# EAGLE board microEEG321w (EAGLE 6.5.0), part 1 of 3
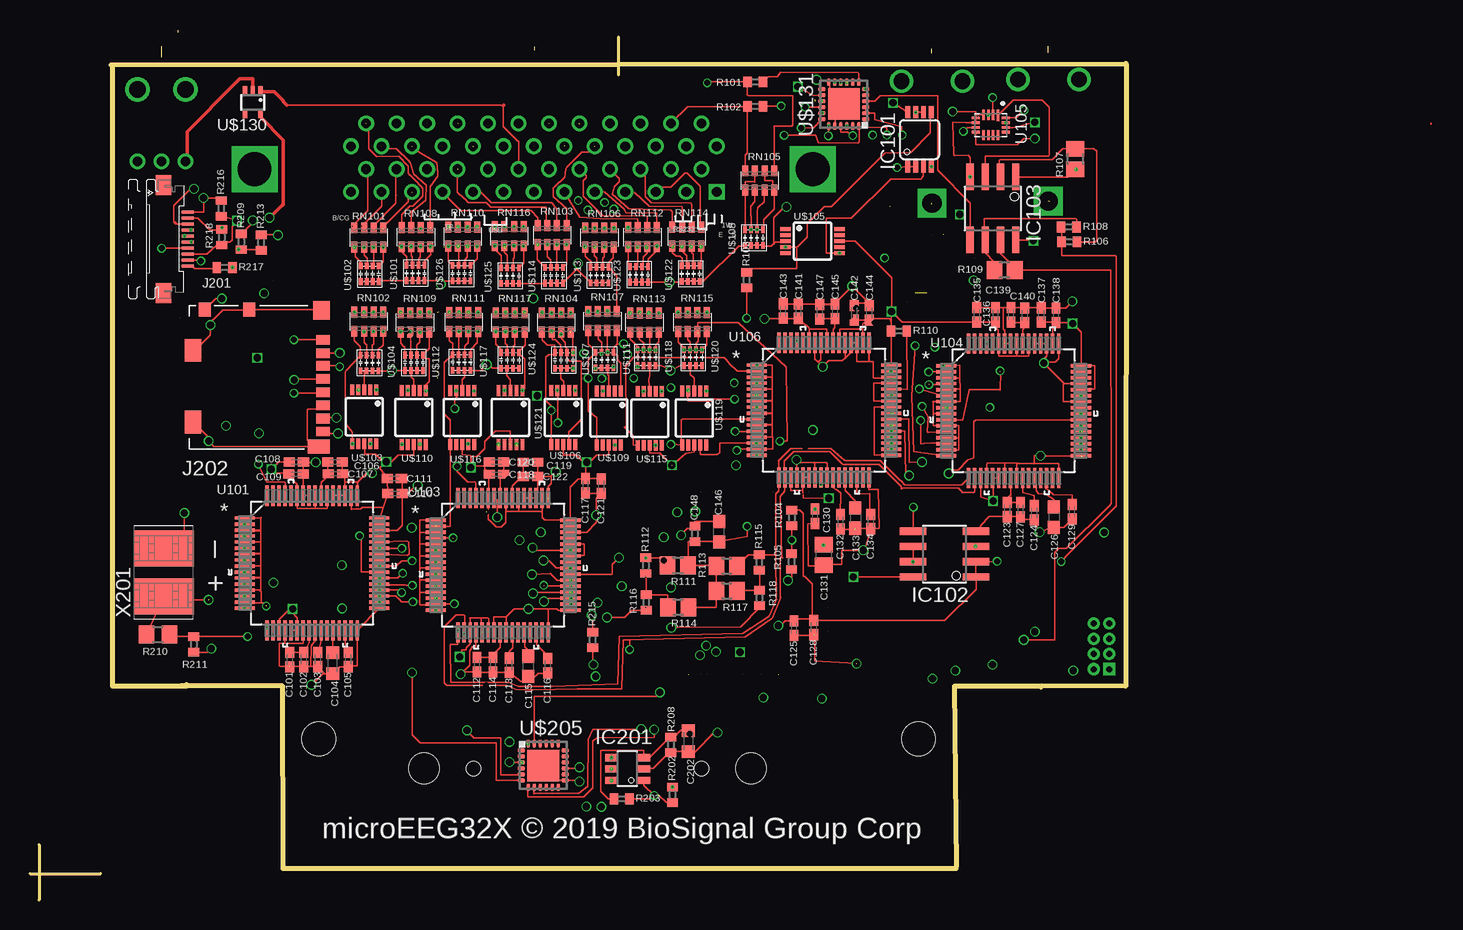
[diagram p7: board, top side]
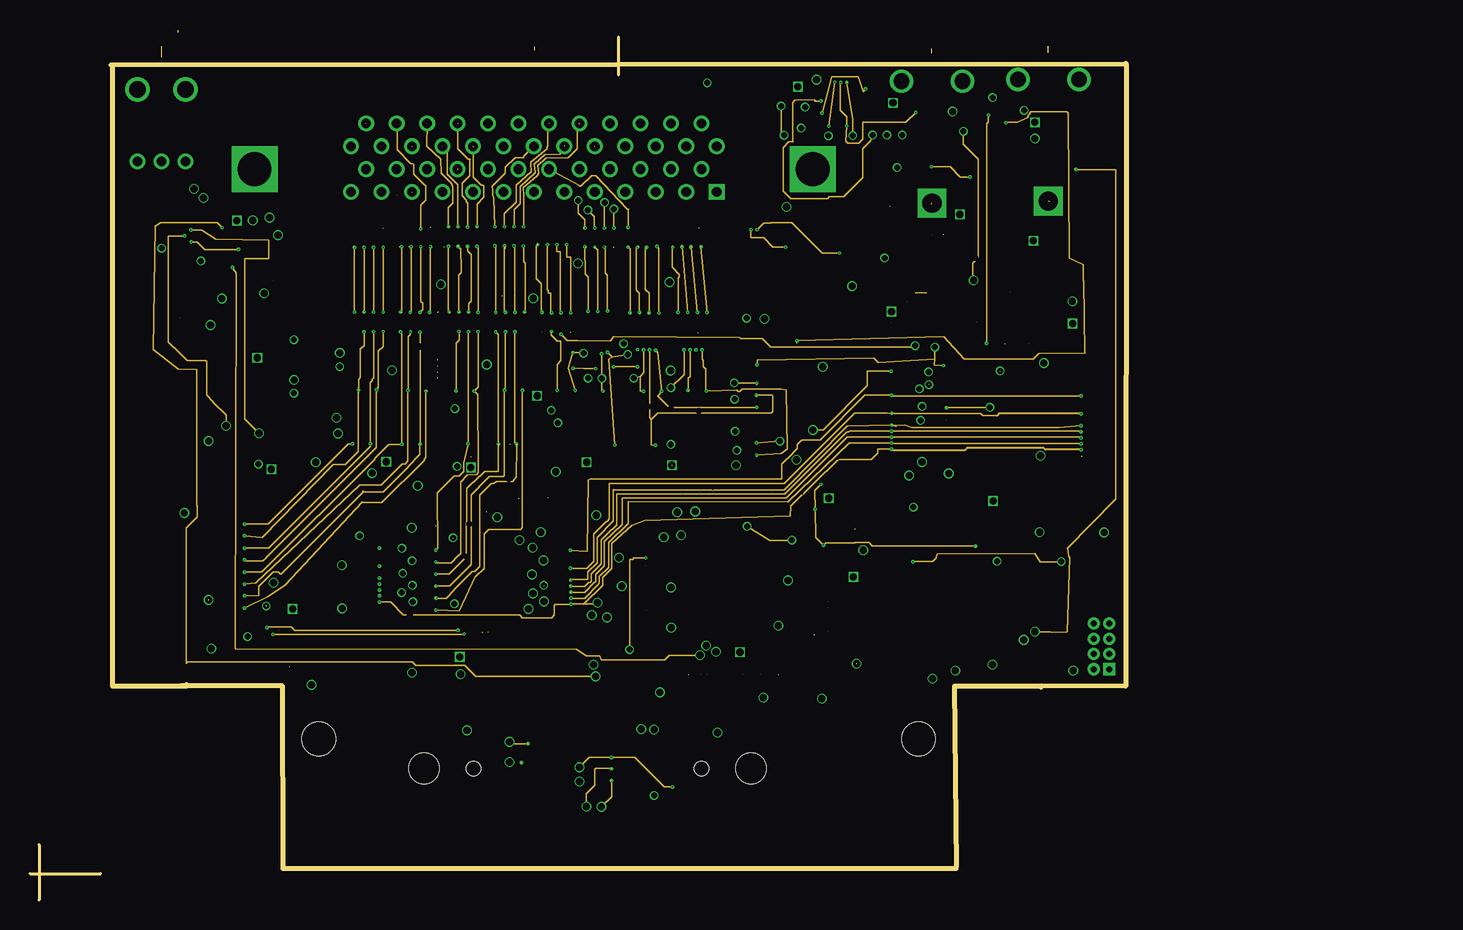
[diagram p8: board, inner layer Route2]
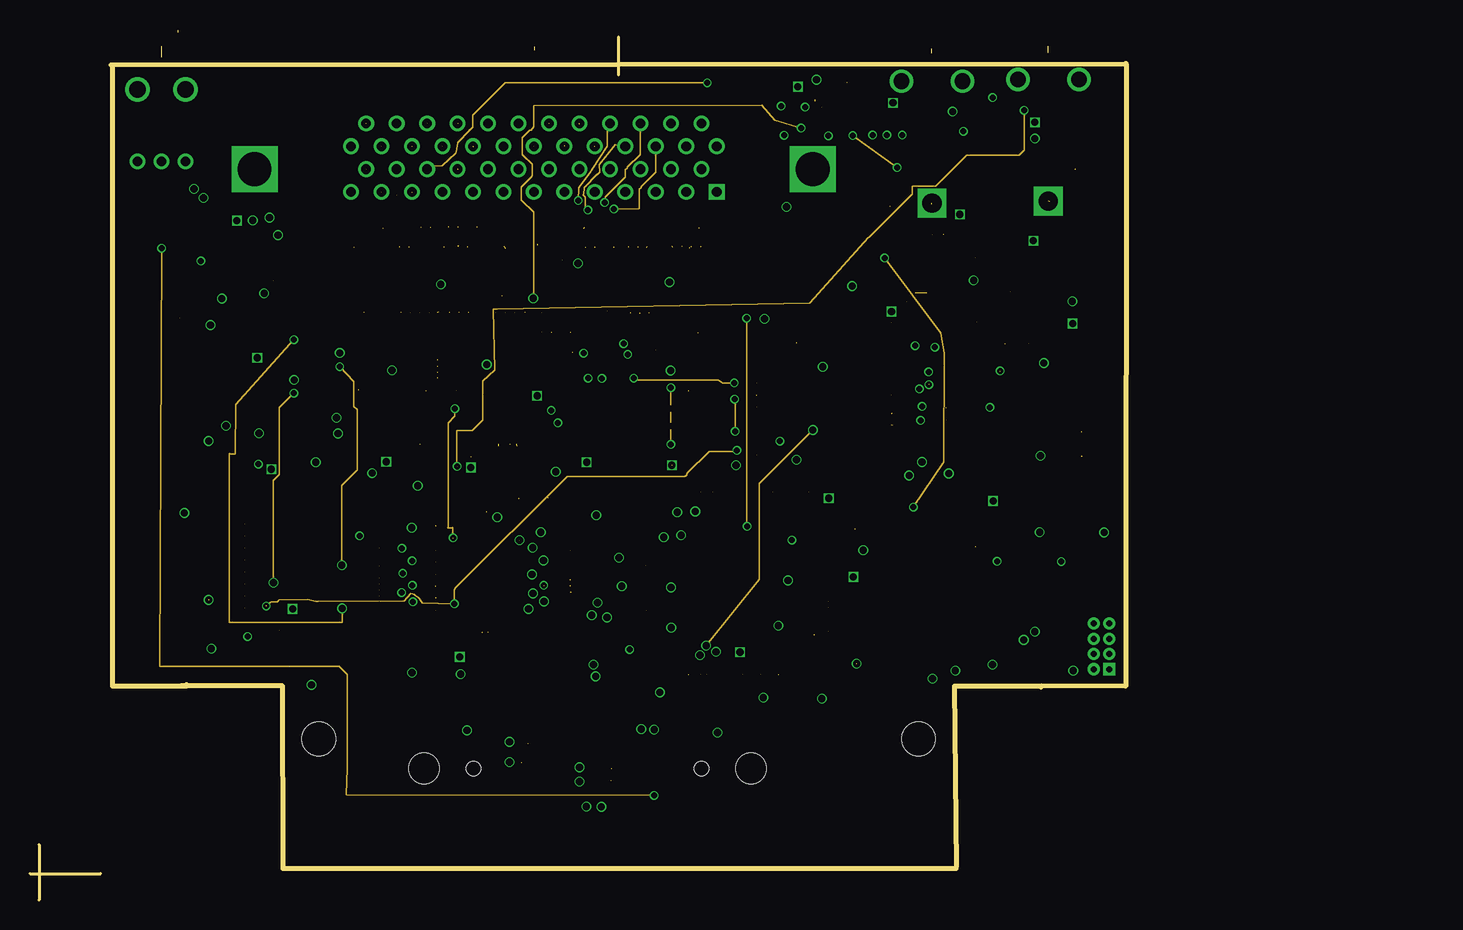
[diagram p9: board, inner layer Route3]
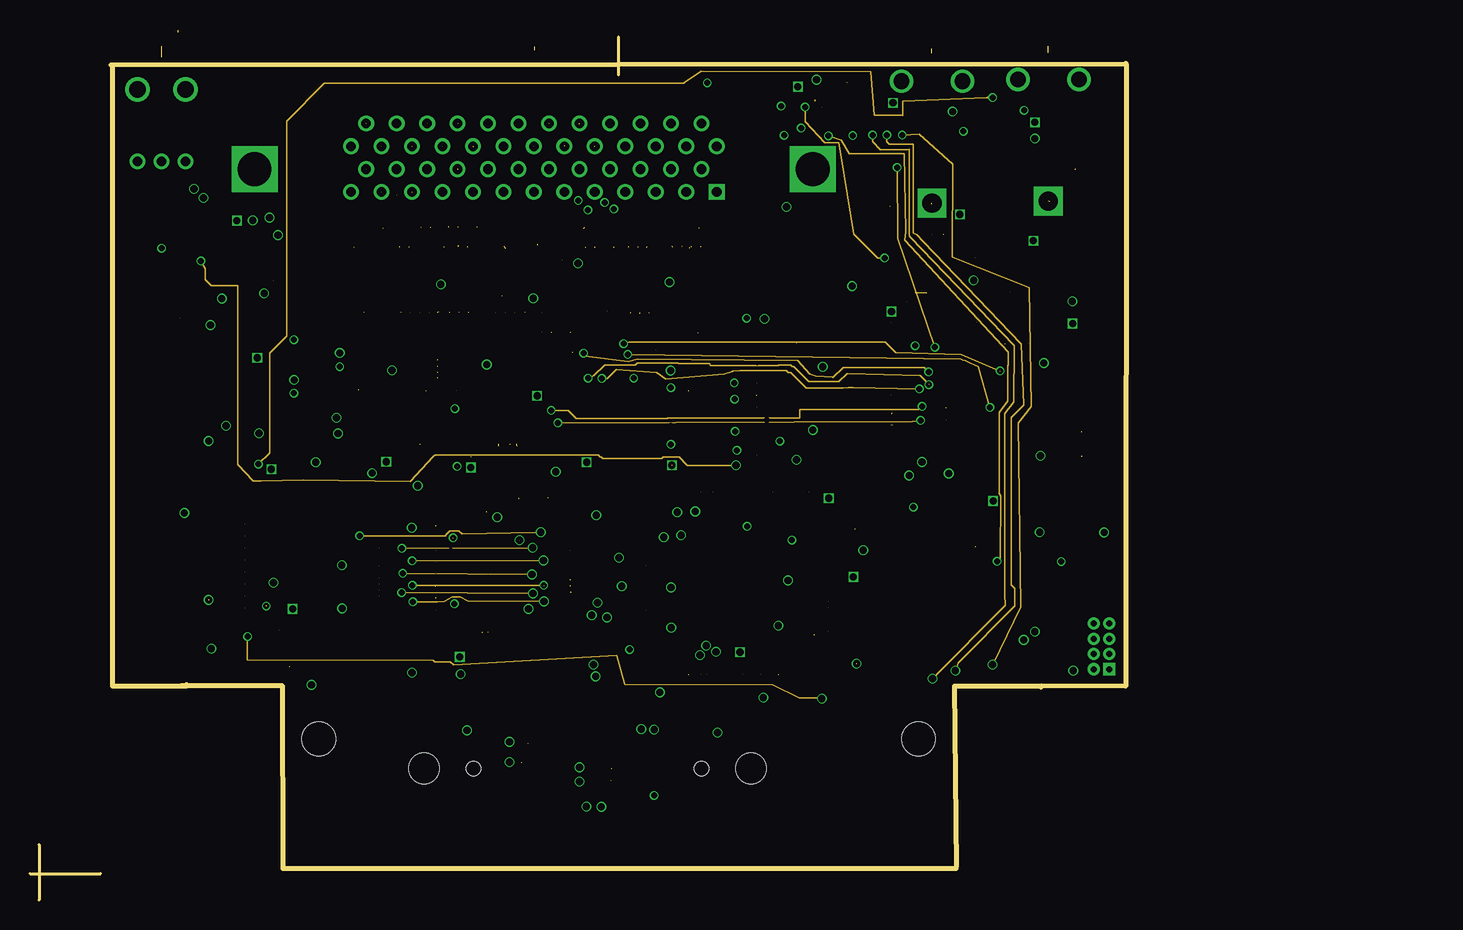
[diagram p10: board, inner layer Route4]
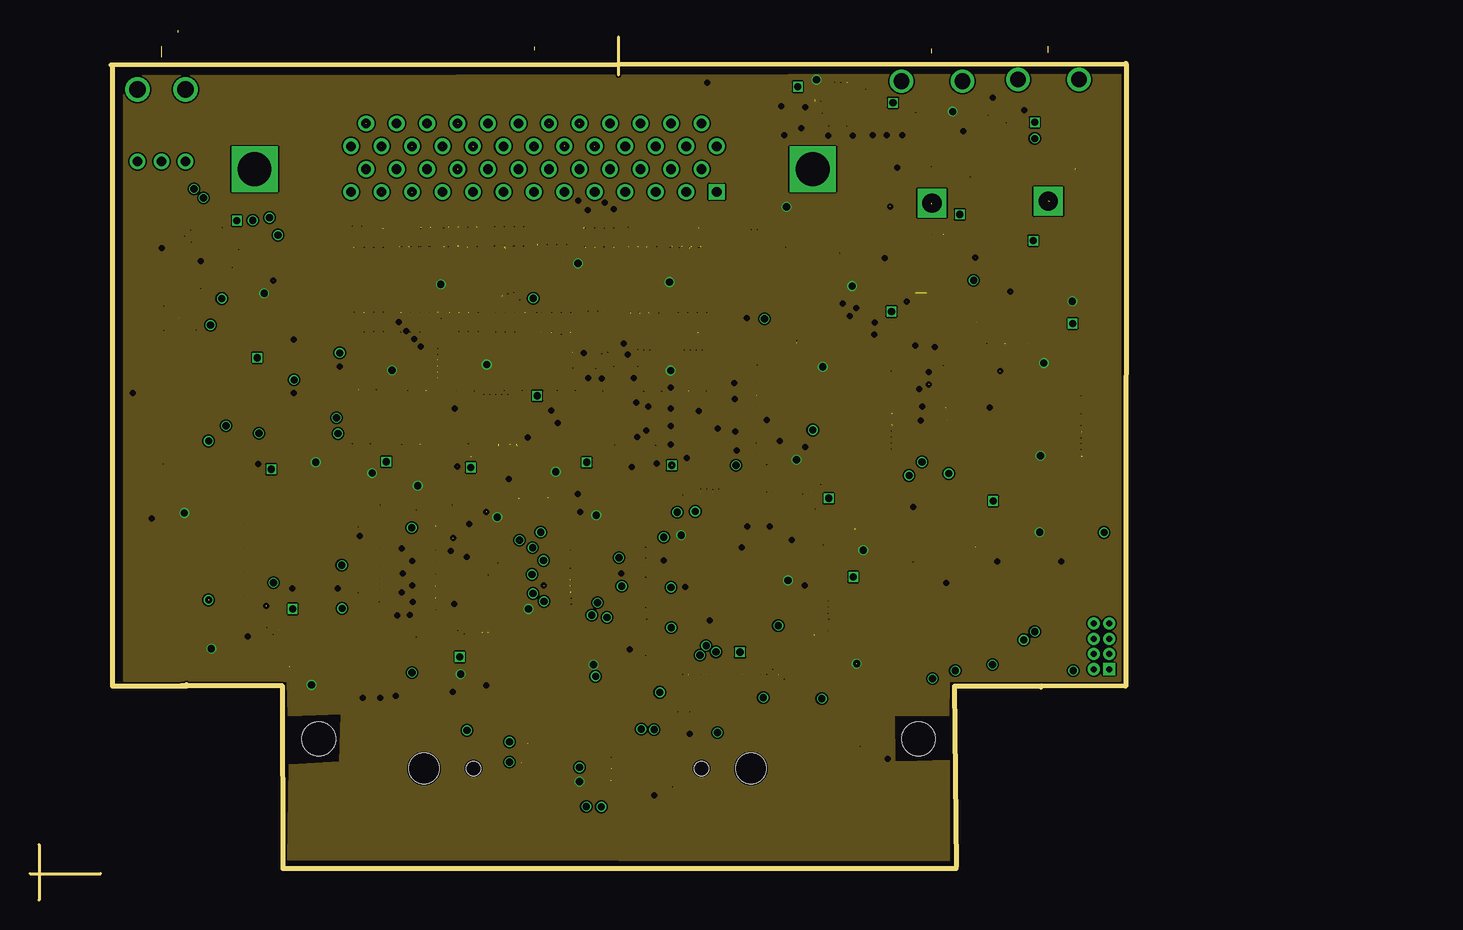
[diagram p11: board, inner layer Route5]
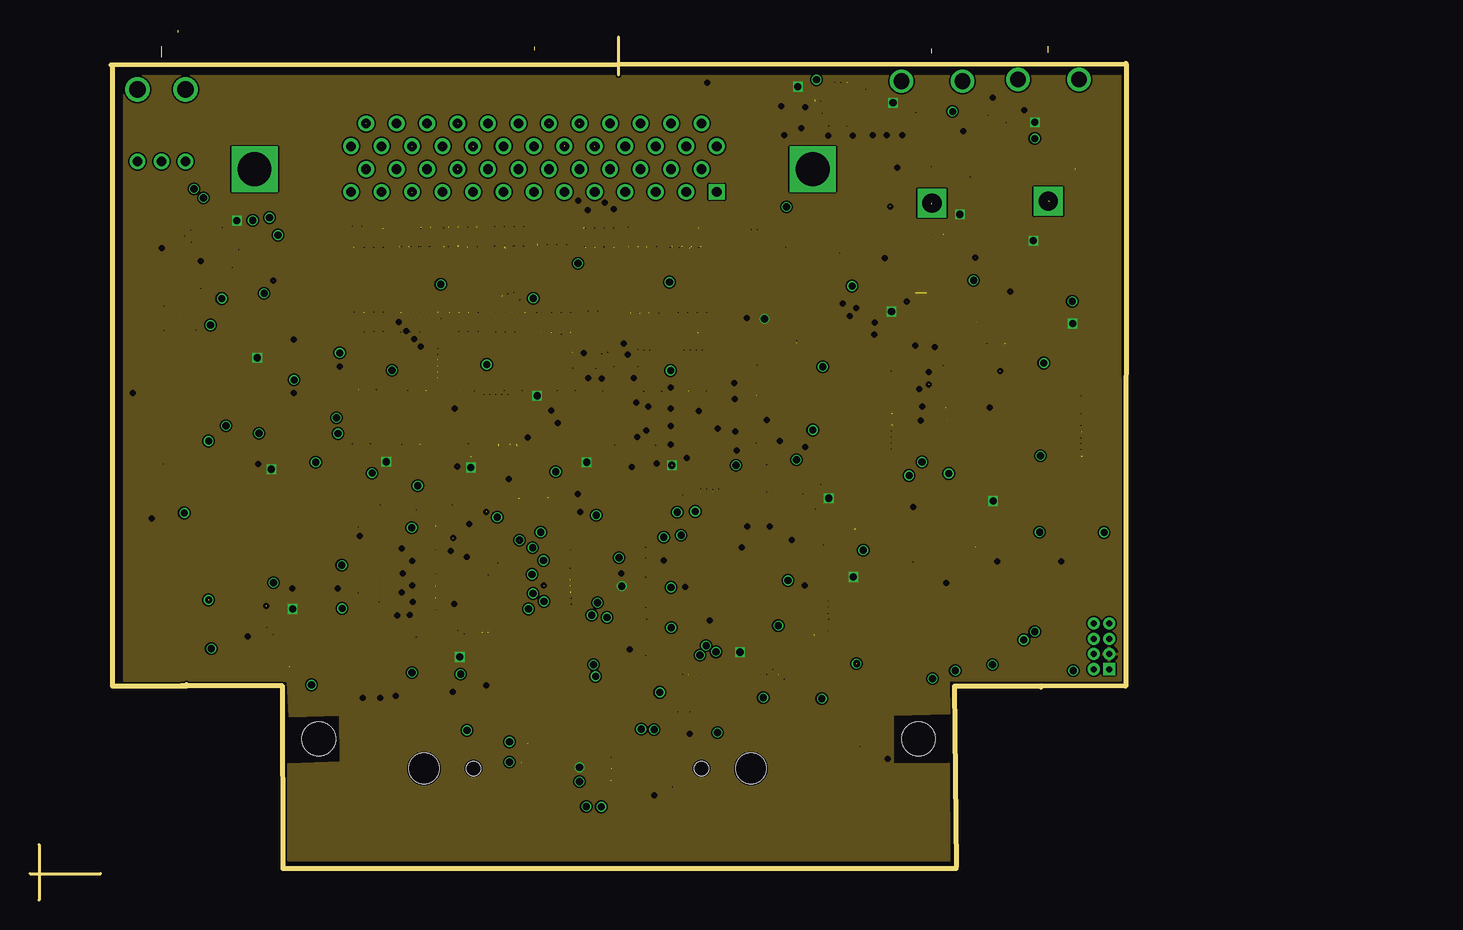
[diagram p12: board, inner layer Route12]
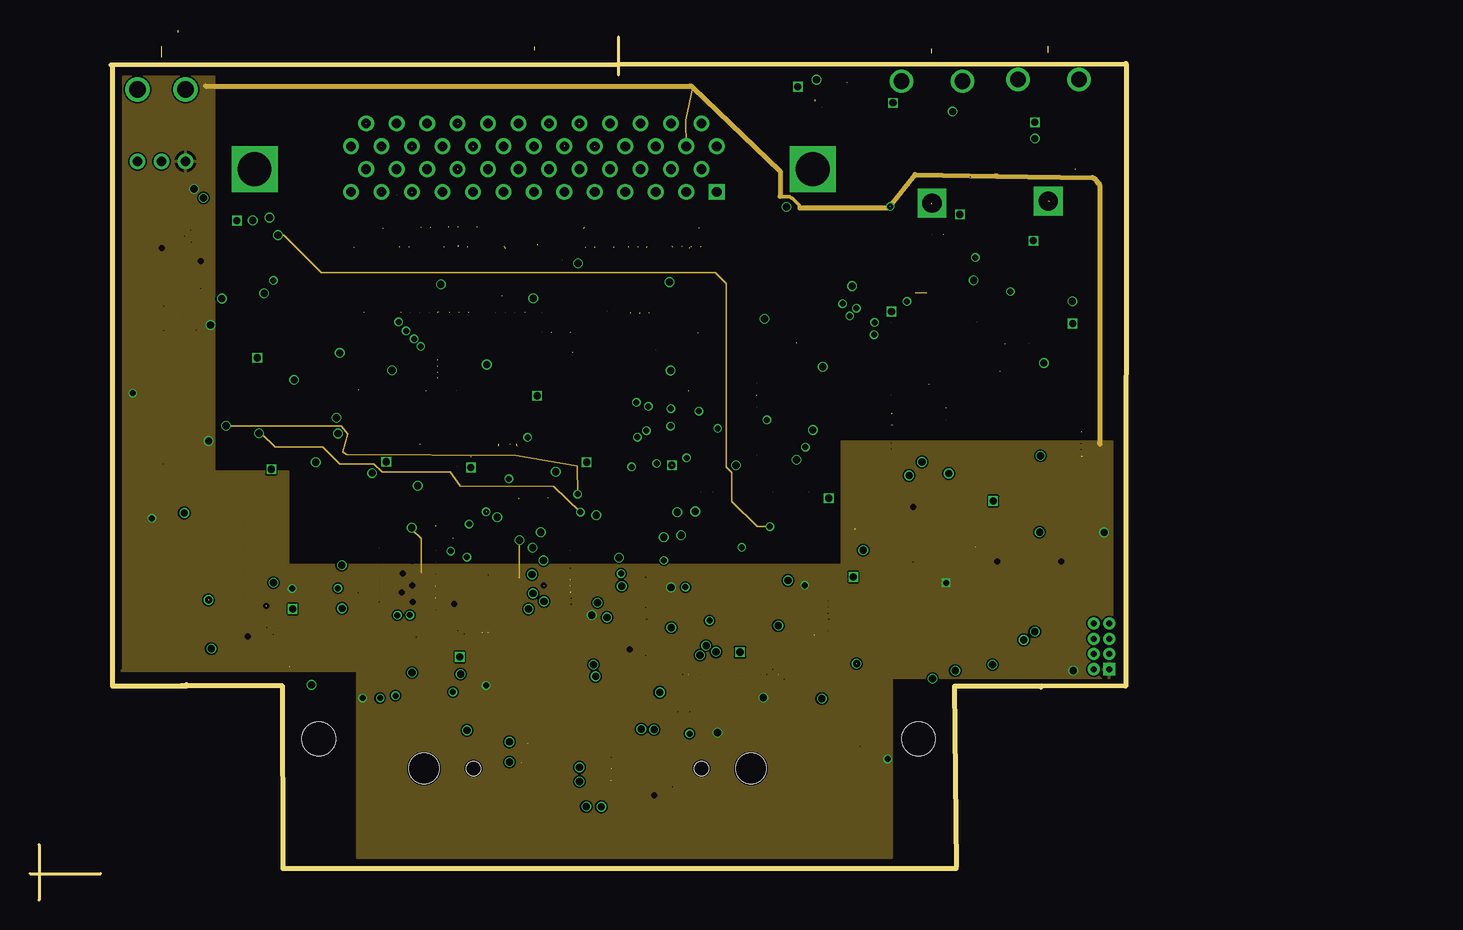
[diagram p13: board, inner layer Route13]
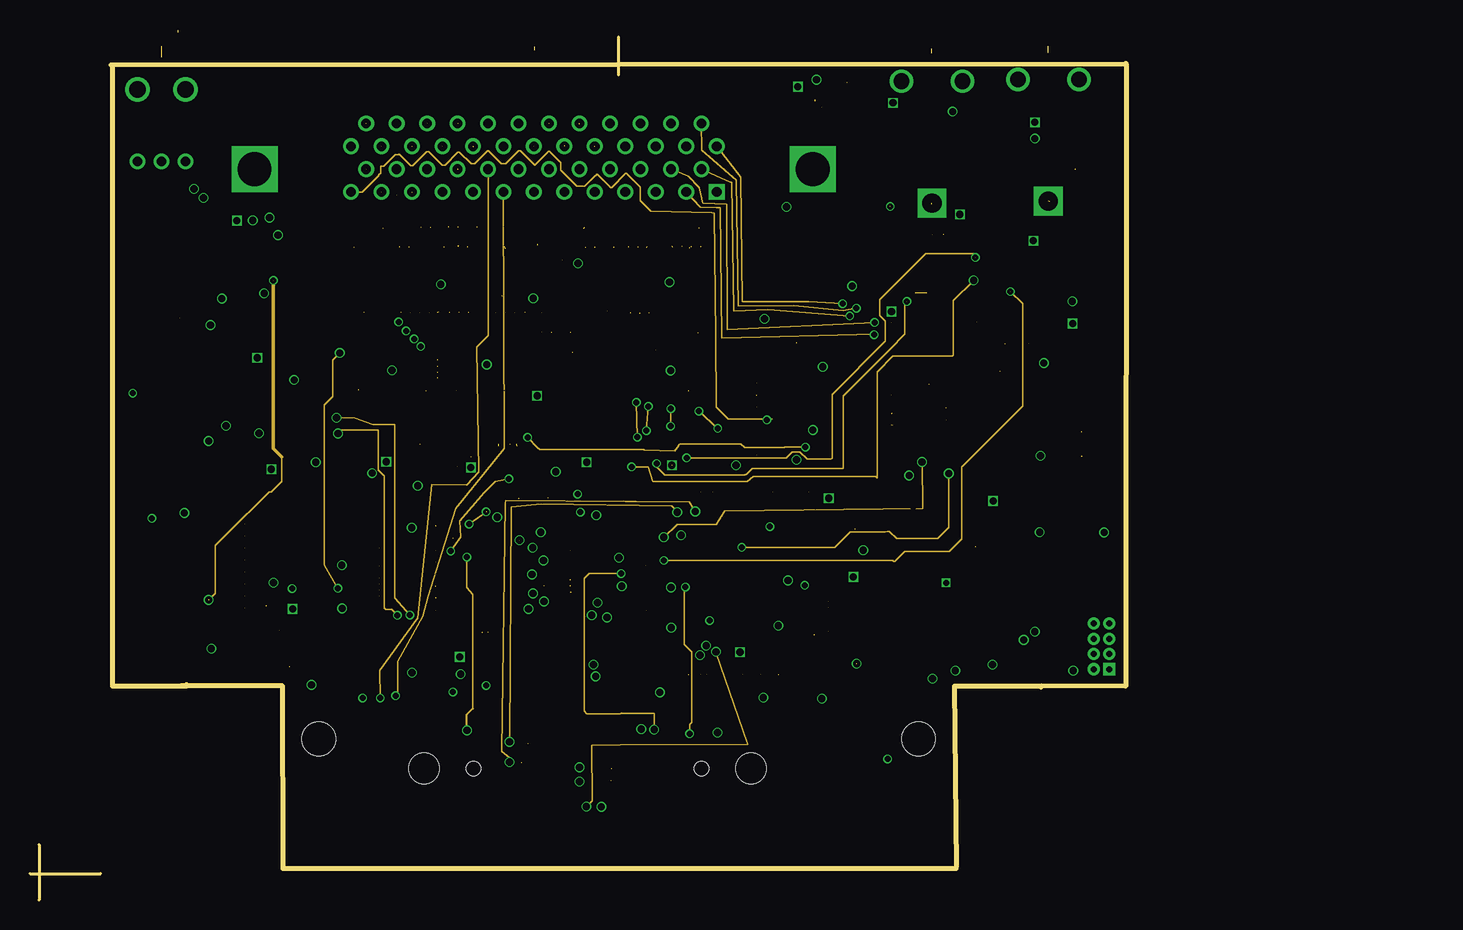
[diagram p14: board, inner layer Route14]
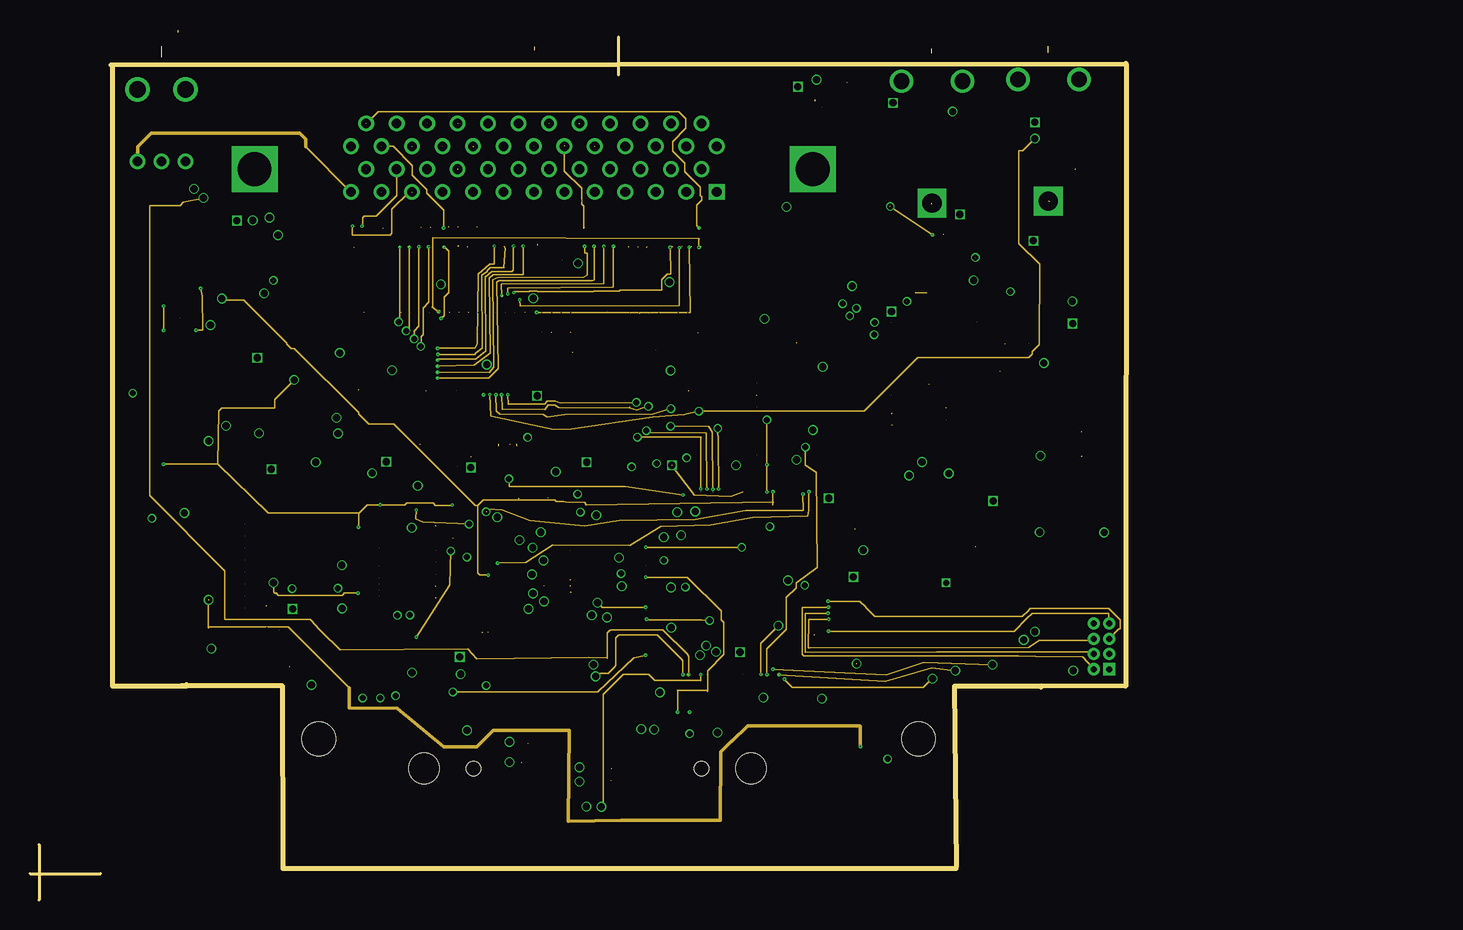
[diagram p15: board, inner layer Route15]
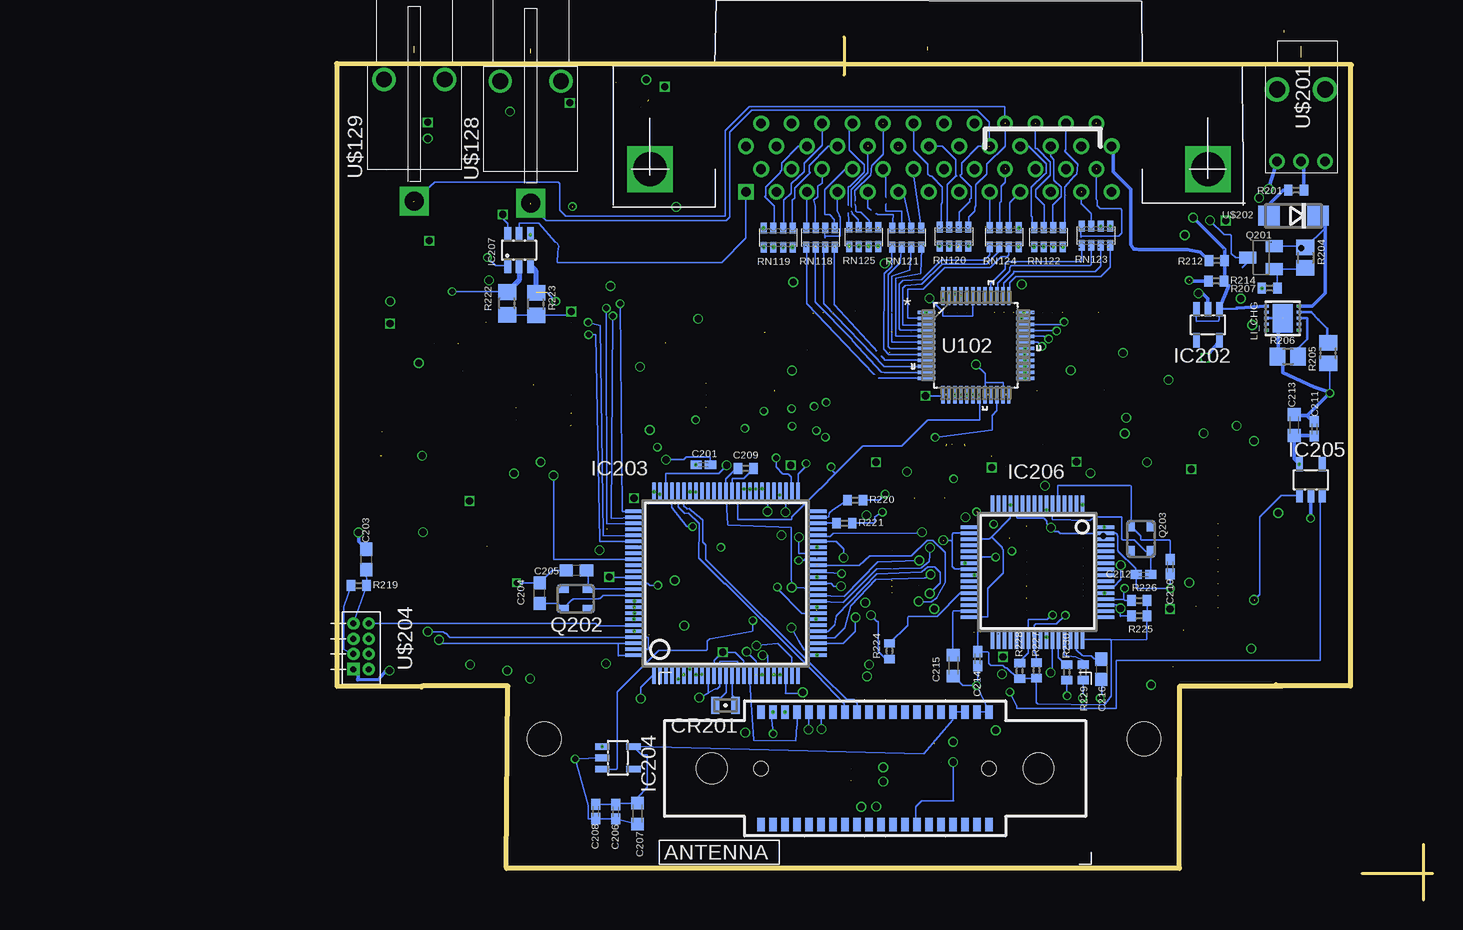
[diagram p16: board, bottom side, seen from below]

Size 91.34 x 72.52 mm. Coordinates in mm from the lower left corner, seen from the top.
Outline: 21.11,2.67 21.06,17.82 12.56,17.82
Outline: 77.21,2.77 77.06,17.82 84.16,17.82
Outline: 49.04,71.94 49.04,68.76
Outline: 6.76,69.62 91.31,69.72
Outline: 91.34,69.72 91.31,17.8 84.26,17.82 84.26,17.72
Outline: 6.86,69.62 6.86,17.82 13.06,17.82 13.06,17.92
Outline: 12.36,72.32 12.36,72.52
Outline: 42.06,70.82 42.06,71.12
Outline: 10.96,70.27 10.96,71.17
Outline: 75.16,70.57 75.16,70.97
Outline: 84.86,70.62 84.86,71.17
Outline: 21.09,2.62 77.16,2.62
Outline: 0,2.18 5.89,2.18
Outline: 0.76,4.6 0.76,0
Copper layers [4:(1*2*3*4*5*12*13*14*15*16):13]: Top 0.035mm / dielectric 0.15mm / Route2 0.035mm / dielectric 0.15mm / Route3 0.035mm / dielectric 0.15mm / Route4 0.035mm / dielectric 0.15mm / Route5 0.035mm / dielectric 0.2mm / Route12 0.035mm / dielectric 0.15mm / Route13 0.035mm / dielectric 0.15mm / Route14 0.035mm / dielectric 0.15mm / Route15 0.035mm / dielectric 0.15mm / Bottom 0.035mm
Design rules "EEG813 *": minimum track width 0.11938125mm, minimum drill 12mil, track to track 5mil, track to pad 5mil, pad to pad 5mil, via to via 5mil, smd to smd 5mil, copper to edge 5mil, drill to drill 5mil, minimum pad ring 10mil, minimum via ring 4mil, stop-mask expansion 5mil, vias tented up to drill 0mil, thermal gap 10mil
Holes 2.8 mm at 74.04,13.42 24.06,13.42

## Footprints (pad centres in the part's own frame; a part is rotated, then mirrored left to right if it is on the bottom)
C0402K = smd 0.925 x 0.74: 1 -0.6,0; 2 0.6,0
C0603K = smd 1.05 x 1.08: 1 -0.875,0; 2 0.875,0
C0603 = smd 1.1 x 1: 1 -0.85,0; 2 0.85,0
C0805 = smd 1.3 x 1.5: 1 -0.85,0; 2 0.85,0
C0402 = smd 0.7 x 0.9: 1 -0.65,0; 2 0.65,0
FC-12M = smd 0.7 x 1.4: 1 -0.85,0; 2 0.85,0
MSOP08 = smd 0.4 x 1: 1 -0.976,-2.263; 2 -0.326,-2.263; 3 0.324,-2.263; 4 0.974,-2.263; 5 0.974,2.262; 6 0.324,2.262; 7 -0.326,2.262; 8 -0.976,2.262
SO08 = smd 0.61 x 2.21: 1 -1.905,-2.616; 2 -0.635,-2.616; 3 0.635,-2.616; 4 1.905,-2.616; 5 1.905,2.616; 6 0.635,2.616; 7 -0.635,2.616; 8 -1.905,2.616
SOT23-6 = smd 0.6 x 1.05: 1 -0.95,-1.35; 2 0,-1.35; 3 0.95,-1.35; 4 0.95,1.35; 5 0,1.35; 6 -0.95,1.35
SOT23-DBV = smd 0.55 x 1.2: 1 -0.95,-1.3; 2 0,-1.3; 3 0.95,-1.3; 4 0.95,1.3; 5 -0.95,1.3
PZ_S-PQFP-G100 = smd 0.3 x 1.6: 1 -6,-7.6; 2 -5.5,-7.6; 3 -5,-7.6; 4 -4.5,-7.6; 5 -4,-7.6; 6 -3.5,-7.6; 7 -3,-7.6; 8 -2.5,-7.6; 9 -2,-7.6; 10 -1.5,-7.6; 11 -1,-7.6; 12 -0.5,-7.6; 13 0,-7.6; 14 0.5,-7.6; 15 1,-7.6; 16 1.5,-7.6; 17 2,-7.6; 18 2.5,-7.6; 19 3,-7.6; 20 3.5,-7.6; 21 4,-7.6; 22 4.5,-7.6; 23 5,-7.6; 24 5.5,-7.6; 25 6,-7.6; 51 6,7.6; 52 5.5,7.6; 53 5,7.6; 54 4.5,7.6; 55 4,7.6; 56 3.5,7.6; 57 3,7.6; 58 2.5,7.6; 59 2,7.6; 60 1.5,7.6; 61 1,7.6; 62 0.5,7.6; 63 0,7.6; 64 -0.5,7.6; 65 -1,7.6; 66 -1.5,7.6; 67 -2,7.6; 68 -2.5,7.6; 69 -3,7.6; 70 -3.5,7.6; 71 -4,7.6; 72 -4.5,7.6; 73 -5,7.6; 74 -5.5,7.6; 75 -6,7.6 | smd 1.6 x 0.3: 26 7.6,-6; 27 7.6,-5.5; 28 7.6,-5; 29 7.6,-4.5; 30 7.6,-4; 31 7.6,-3.5; 32 7.6,-3; 33 7.6,-2.5; 34 7.6,-2; 35 7.6,-1.5; 36 7.6,-1; 37 7.6,-0.5; 38 7.6,0; 39 7.6,0.5; 40 7.6,1; 41 7.6,1.5; 42 7.6,2; 43 7.6,2.5; 44 7.6,3; 45 7.6,3.5; 46 7.6,4; 47 7.6,4.5; 48 7.6,5; 49 7.6,5.5; 50 7.6,6; 76 -7.6,6; 77 -7.6,5.5; 78 -7.6,5; 79 -7.6,4.5; 80 -7.6,4; 81 -7.6,3.5; 82 -7.6,3; 83 -7.6,2.5; 84 -7.6,2; 85 -7.6,1.5; 86 -7.6,1; 87 -7.6,0.5; 88 -7.6,0; 89 -7.6,-0.5; 90 -7.6,-1; 91 -7.6,-1.5; 92 -7.6,-2; 93 -7.6,-2.5; 94 -7.6,-3; 95 -7.6,-3.5; 96 -7.6,-4; 97 -7.6,-4.5; 98 -7.6,-5; 99 -7.6,-5.5; 100 -7.6,-6
SQFP-S-10X10-64 = smd 0.3 x 1.6: 1 -3.75,-5.6; 2 -3.25,-5.6; 3 -2.75,-5.6; 4 -2.25,-5.6; 5 -1.75,-5.6; 6 -1.25,-5.6; 7 -0.75,-5.6; 8 -0.25,-5.6; 9 0.25,-5.6; 10 0.75,-5.6; 11 1.25,-5.6; 12 1.75,-5.6; 13 2.25,-5.6; 14 2.75,-5.6; 15 3.25,-5.6; 16 3.75,-5.6; 33 3.75,5.6; 34 3.25,5.6; 35 2.75,5.6; 36 2.25,5.6; 37 1.75,5.6; 38 1.25,5.6; 39 0.75,5.6; 40 0.25,5.6; 41 -0.25,5.6; 42 -0.75,5.6; 43 -1.25,5.6; 44 -1.75,5.6; 45 -2.25,5.6; 46 -2.75,5.6; 47 -3.25,5.6; 48 -3.75,5.6 | smd 1.6 x 0.3: 17 5.6,-3.75; 18 5.6,-3.25; 19 5.6,-2.75; 20 5.6,-2.25; 21 5.6,-1.75; 22 5.6,-1.25; 23 5.6,-0.75; 24 5.6,-0.25; 25 5.6,0.25; 26 5.6,0.75; 27 5.6,1.25; 28 5.6,1.75; 29 5.6,2.25; 30 5.6,2.75; 31 5.6,3.25; 32 5.6,3.75; 49 -5.6,3.75; 50 -5.6,3.25; 51 -5.6,2.75; 52 -5.6,2.25; 53 -5.6,1.75; 54 -5.6,1.25; 55 -5.6,0.75; 56 -5.6,0.25; 57 -5.6,-0.25; 58 -5.6,-0.75; 59 -5.6,-1.25; 60 -5.6,-1.75; 61 -5.6,-2.25; 62 -5.6,-2.75; 63 -5.6,-3.25; 64 -5.6,-3.75
SOT23-6L = smd 0.55 x 1.2: 1 -0.95,-1.3; 2 0,-1.3; 3 0.95,-1.3; 4 0.95,1.3; 5 0,1.3; 6 -0.95,1.3
XF2L-1025-1 = smd 1 x 0.25: 1 1.905,2.25; 2 1.905,1.75; 3 1.905,1.25; 4 1.905,0.75; 5 1.905,0.25; 6 1.905,-0.25; 7 1.905,-0.75; 8 1.905,-1.25; 9 1.905,-1.75; 10 1.905,-2.25 | smd 1.3 x 1.65: P$1 -0.1,4.5; P$2 -0.1,-4.5
MOLEX_SD = smd 1.55 x 1.35: G$1 5.565,0.375 | smd 1.17 x 1.8: G$2 -5.76,0.6 | smd 1.9 x 1.35: G$3 -3.73,11.075; G$4 2.24,11.075 | smd 0.8 x 1.1: P$1 3.105,0.25; P$2 2.005,0.25; P$3 0.955,0.25; P$4 -0.145,0.25; P$5 -1.245,0.25; P$6 -2.345,0.25; P$7 -3.445,0.25 | smd 0.75 x 1.1: P$8 -4.545,0.25 | smd 1.2 x 1: S$1 5.64,10.1; S$2 5.64,6.4
DFN10-3X3 = smd 0.25 x 0.45: 1 -1,-1.35; 2 -0.5,-1.35; 3 0,-1.35; 4 0.5,-1.35; 5 1,-1.35; 6 1,1.35; 7 0.5,1.35; 8 0,1.35; 9 -0.5,1.35; 10 -1,1.35 | smd 2.38 x 1.65: EXP 0,0
SOT23-BEC = smd 1 x 1.4: B -0.95,-1.1; C 0,1.1; E 0.95,-1.1
FA238V = smd 0.9 x 0.65: 1 -1.05,-0.825; 2 1.05,-0.825; 3 1.05,0.825; 4 -1.05,0.825
R0402 = smd 0.7 x 0.9: 1 -0.65,0; 2 0.65,0
R0805 = smd 1.3 x 1.5: 1 -0.85,0; 2 0.85,0
R0805' = smd 1.3 x 1.5: 1 -0.95,0; 2 0.95,0
CTS742C083 = smd 0.5 x 0.9: 1 -1.2,-0.8; 2 -0.4,-0.8; 3 0.4,-0.8; 4 1.2,-0.8; 5 1.2,0.8; 6 0.4,0.8; 7 -0.4,0.8; 8 -1.2,0.8
PAG64 = smd 1.676 x 0.279: 1 -5.613,3.759; 2 -5.613,3.251; 3 -5.613,2.743; 4 -5.613,2.261; 5 -5.613,1.753; 6 -5.613,1.245; 7 -5.613,0.762; 8 -5.613,0.254; 9 -5.613,-0.254; 10 -5.613,-0.762; 11 -5.613,-1.245; 12 -5.613,-1.753; 13 -5.613,-2.261; 14 -5.613,-2.743; 15 -5.613,-3.251; 16 -5.613,-3.759; 33 5.613,-3.759; 34 5.613,-3.251; 35 5.613,-2.743; 36 5.613,-2.261; 37 5.613,-1.753; 38 5.613,-1.245; 39 5.613,-0.762; 40 5.613,-0.254; 41 5.613,0.254; 42 5.613,0.762; 43 5.613,1.245; 44 5.613,1.753; 45 5.613,2.261; 46 5.613,2.743; 47 5.613,3.251; 48 5.613,3.759 | smd 0.279 x 1.676: 17 -3.759,-5.613; 18 -3.251,-5.613; 19 -2.743,-5.613; 20 -2.261,-5.613; 21 -1.753,-5.613; 22 -1.245,-5.613; 23 -0.762,-5.613; 24 -0.254,-5.613; 25 0.254,-5.613; 26 0.762,-5.613; 27 1.245,-5.613; 28 1.753,-5.613; 29 2.261,-5.613; 30 2.743,-5.613; 31 3.251,-5.613; 32 3.759,-5.613; 49 3.759,5.613; 50 3.251,5.613; 51 2.743,5.613; 52 2.261,5.613; 53 1.753,5.613; 54 1.245,5.613; 55 0.762,5.613; 56 0.254,5.613; 57 -0.254,5.613; 58 -0.762,5.613; 59 -1.245,5.613; 60 -1.753,5.613; 61 -2.261,5.613; 62 -2.743,5.613; 63 -3.251,5.613; 64 -3.759,5.613
SU_48 = smd 1.473 x 0.279: 1 -4.115,2.743; 2 -4.115,2.261; 3 -4.115,1.753; 4 -4.115,1.245; 5 -4.115,0.762; 6 -4.115,0.254; 7 -4.115,-0.254; 8 -4.115,-0.762; 9 -4.115,-1.245; 10 -4.115,-1.753; 11 -4.115,-2.261; 12 -4.115,-2.743; 25 4.115,-2.743; 26 4.115,-2.261; 27 4.115,-1.753; 28 4.115,-1.245; 29 4.115,-0.762; 30 4.115,-0.254; 31 4.115,0.254; 32 4.115,0.762; 33 4.115,1.245; 34 4.115,1.753; 35 4.115,2.261; 36 4.115,2.743 | smd 0.279 x 1.473: 13 -2.743,-4.115; 14 -2.261,-4.115; 15 -1.753,-4.115; 16 -1.245,-4.115; 17 -0.762,-4.115; 18 -0.254,-4.115; 19 0.254,-4.115; 20 0.762,-4.115; 21 1.245,-4.115; 22 1.753,-4.115; 23 2.261,-4.115; 24 2.743,-4.115; 37 2.743,4.115; 38 2.261,4.115; 39 1.753,4.115; 40 1.245,4.115; 41 0.762,4.115; 42 0.254,4.115; 43 -0.254,4.115; 44 -0.762,4.115; 45 -1.245,4.115; 46 -1.753,4.115; 47 -2.261,4.115; 48 -2.743,4.115
QFN40P260X180X60-16N = smd 0.94 x 0.22: 1 -0.795,0.6 | smd 0.84 x 0.22: 2 -0.845,0.2; 3 -0.845,-0.2; 4 -0.845,-0.6; 9 0.845,-0.6; 10 0.845,-0.2; 11 0.845,0.2; 12 0.845,0.6 | smd 0.22 x 0.64: 5 -0.6,-1.245; 6 -0.2,-1.245; 7 0.2,-1.245; 8 0.6,-1.245; 13 0.6,1.245; 14 0.2,1.245; 15 -0.2,1.245; 16 -0.6,1.245
CAP0508X4 = smd 0.3 x 0.56: P$1 -0.75,-0.65; P$2 -0.25,-0.65; P$3 0.25,-0.65; P$4 0.75,-0.65; P$5 0.75,0.65; P$6 0.25,0.65; P$7 -0.25,0.65; P$8 -0.75,0.65
UMAX10 = smd 0.32 x 0.9: 1 -1,-2.25; 2 -0.5,-2.25; 3 0,-2.25; 4 0.5,-2.25; 5 1,-2.25; 6 1,2.25; 7 0.5,2.25; 8 0,2.25; 9 -0.5,2.25; 10 -1,2.25
THROUGHHOLERECEPT = drill 2.8 square: M$1 -23.266,0; M$2 23.241,0 | drill 0.8 square: P$1 15.24,1.905 | drill 0.8: P$2 13.97,0; P$3 12.7,1.905; P$4 11.43,0; P$5 10.16,1.905; P$6 8.89,0; P$7 7.62,1.905; P$8 6.35,0; P$9 5.08,1.905; P$10 3.81,0; P$11 2.54,1.905; P$12 1.27,0; P$13 0,1.905; P$14 -1.27,0; P$15 -2.54,1.905; P$16 -3.81,0; P$17 -5.08,1.905; P$18 -6.35,0; P$19 -7.62,1.905; P$20 -8.89,0; P$21 -10.16,1.905; P$22 -11.43,0; P$23 -12.7,1.905; P$24 -13.97,0; P$25 -15.24,1.905; P$26 15.24,-1.905; P$27 13.97,-3.81; P$28 12.7,-1.905; P$29 11.43,-3.81; P$30 10.16,-1.905; P$31 8.89,-3.81; P$32 7.62,-1.905; P$33 6.35,-3.81; P$34 5.08,-1.905; P$35 3.81,-3.81; P$36 2.54,-1.905; P$37 1.27,-3.81; P$38 0,-1.905; P$39 -1.27,-3.81; P$40 -2.54,-1.905; P$41 -3.81,-3.81; P$42 -5.08,-1.905; P$43 -6.35,-3.81; P$44 -7.62,-1.905; P$45 -8.89,-3.81; P$46 -10.16,-1.905; P$47 -11.43,-3.81; P$48 -12.7,-1.905; P$49 -13.97,-3.81; P$50 -15.24,-1.905
TOUCHPROOF = drill 1.6 square: P$1 0,-11.43 | drill 1.3: P$2 -2.54,-1.27; P$3 2.54,-1.27
DCK = smd 0.35 x 0.8: 1 -0.65,-0.925; 2 0,-0.925; 3 0.65,-0.925; 4 0.65,0.925; 5 -0.65,0.925
TQFN24-EP = smd 0.6 x 0.3: 1 -1.825,1.25; 2 -1.825,0.75; 3 -1.825,0.25; 4 -1.825,-0.25; 5 -1.825,-0.75; 6 -1.825,-1.25; 13 1.825,-1.25; 14 1.825,-0.75; 15 1.825,-0.25; 16 1.825,0.25; 17 1.825,0.75; 18 1.825,1.25 | smd 0.3 x 0.6: 7 -1.25,-1.825; 8 -0.75,-1.825; 9 -0.25,-1.825; 10 0.25,-1.825; 11 0.75,-1.825; 12 1.25,-1.825; 19 1.25,1.825; 20 0.75,1.825; 21 0.25,1.825; 22 -0.25,1.825; 23 -0.75,1.825; 24 -1.25,1.825 | smd 2.63 x 2.63: EXP 0,0
PJ040 = drill 0.8: P$1 8,0; P$2 8,-2; P$3 8,2 | drill 1.35: P$4 2,2; P$5 2,-2
DO214AC = smd 1.8 x 1.7: A 2.05,0; C -2.05,0
FSI-110-03-X-D-E-AD = smd 0.61 x 1.13: 1 -9.5,-4.693; 2 -8.5,-4.693; 3 -7.5,-4.693; 4 -6.5,-4.693; 5 -5.5,-4.693; 6 -4.5,-4.693; 7 -3.5,-4.693; 8 -2.5,-4.693; 9 -1.5,-4.693; 10 -0.5,-4.693; 11 0.5,-4.693; 12 1.5,-4.693; 13 2.5,-4.693; 14 3.5,-4.693; 15 4.5,-4.693; 16 5.5,-4.693; 17 6.5,-4.693; 18 7.5,-4.693; 19 8.5,-4.693; 20 9.5,-4.693; A1 -9.5,4.693; A2 -8.5,4.693; A3 -7.5,4.693; A4 -6.5,4.693; A5 -5.5,4.693; A6 -4.5,4.693; A7 -3.5,4.693; A8 -2.5,4.693; A9 -1.5,4.693; A10 -0.5,4.693; A11 0.5,4.693; A12 1.5,4.693; A13 2.5,4.693; A14 3.5,4.693; A15 4.5,4.693; A16 5.5,4.693; A17 6.5,4.693; A18 7.5,4.693; A19 8.5,4.693; A20 9.5,4.693 | hole 1.194: -9.5,0; 9.5,0 | hole 2.54: -13.62,0; 13.62,0
2X04/90-050 = drill 0.5 pad 0.61 square: P$1 -1.27,1.27 | drill 0.5 pad 0.61: P$2 -1.27,0; P$3 0,1.27; P$4 0,0; P$5 1.27,1.27; P$6 1.27,0; P$7 2.54,1.27; P$8 2.54,0
009176002 = smd 3 x 5: 1 -2,0; 2 2,0

## Placement (x,y rotation side)
C101  10 uF  [C0402K]  21.64,20.03 270 top
C102  [C0402K]  22.82,20.04 270 top
C103  1 uF  [C0402K]  23.99,20.04 270 top
C104  22 uF  [C0603K]  25.21,19.73 270 top
C105  1 uF  [C0402K]  26.52,20.04 270 top
C106  [C0402K]  25.42,36.51 0 top
C107  1 uF  [C0402K]  25.45,35.53 0 top
C108  [C0402K]  22.19,36.51 0 top
C109  1 uF  [C0402K]  22.16,35.49 0 top
C110  [C0402K]  30.41,33.88 0 top
C111  1 uF  [C0402K]  30.36,35.14 0 top
C112  [C0402K]  37.25,19.6 270 top
C113  1 uF  [C0402K]  39.94,19.55 270 top
C114  10 uF  [C0402K]  38.59,19.61 270 top
C115  22 uF  [C0603]  41.5,19.47 270 top
C116  1 uF  [C0402K]  43.14,19.53 270 top
C117  [C0402K]  46.3,34.53 270 top
C118  [C0402K]  38.89,35.48 0 top
C119  [C0402K]  41.7,36.48 0 top
C120  1 uF  [C0402K]  38.87,36.51 0 top
C121  1 uF  [C0402K]  47.6,34.49 270 top
C122  1 uF  [C0402K]  41.71,35.3 0 top
C123  [C0402K]  81.45,32.54 270 top
C124  1 uF  [C0402K]  83.69,32.26 270 top
C125  [C0402K]  63.67,22.65 270 top
C126  22 uF  [C0603]  85.33,31.89 270 top
C127  10 uF  [C0402K]  82.54,32.53 270 top
C128  1 uF  [C0402K]  65.32,22.71 270 top
C129  1 uF  [C0402K]  86.84,32.36 270 top
C130  [C0402K]  65.42,31.98 270 top
C131  10 uF  [C0805]  66.13,28.75 270 top
C132  1 uF  [C0402K]  67.54,31.52 270 top
C133  22 uF  [C0603]  68.79,31.82 270 top
C134  1 uF  [C0402K]  70.07,31.54 270 top
C135  [C0402K]  78.9,48.77 90 top
C136  1 uF  [C0402K]  80.46,48.77 90 top
C137  [C0402K]  84.28,48.76 90 top
C138  1 uF  [C0402K]  85.5,48.74 90 top
C139  [C0402K]  81.75,48.78 90 top
C140  1 uF  [C0402K]  82.91,48.74 90 top
C141  0.1uF  [C0402K]  64.04,49.08 90 top
C142  [C0402K]  68.68,48.94 90 top
C143  1 uF  [C0402K]  62.76,49.09 90 top
C144  1 uF  [C0402K]  69.93,48.95 90 top
C145  1 uF  [C0402K]  67.08,49.05 90 top
C146  22 uF  [C0603]  57.43,30.69 90 top
C147  [C0402K]  65.8,49.01 90 top
C148  1 uF  [C0402]  55.41,30.51 90 top
C201  1 uF  [C0402K]  60.78,36.27 0 bottom
C202  22 uF  [C0603K]  54.86,13.24 270 top
C203  2.2nF  [C0603]  88.85,28.38 90 bottom
C204  18 pF  [C0603]  74.43,25.57 90 bottom
C205  18 pF  [C0603]  71.36,27.46 180 bottom
C206  1 uF  [C0402K]  68.08,7.34 270 bottom
C207  22 uF  [C0603K]  66.26,7.19 270 bottom
C208  1 uF  [C0402K]  69.75,7.37 270 bottom
C209  470nF  [C0402]  57.24,35.97 180 bottom
C210  18pF  [C0402K]  21.86,27.78 270 bottom
C211  1 uF  [C0402K]  9.85,39.26 90 bottom
C212  18pF  [C0402K]  24.09,27.12 180 bottom
C213  22 uF  [C0603K]  11.54,39.58 90 bottom
C214  1 uF  [C0402K]  37.92,20.09 270 bottom
C215  22 uF  [C0603K]  39.94,19.53 270 bottom
C216  22 uF  [C0603]  27.6,19.22 270 bottom
CR201  ABS06-32.768KHz-T  [FC-12M]  58.93,16.2 180 bottom
IC101  AD823  [MSOP08]  74.13,63.4 0 top
IC102  LMP7702U  [SO08]  76.2,28.82 90 top
IC103  LMP7708MA/NOPB  [SO08]  80.24,57.64 180 top
IC201  TLV3501AIDBV  [SOT23-6]  49.8,10.91 90 top
IC202  TPS7323301  [SOT23-DBV]  18.73,47.94 180 bottom
IC203  MSP430F5438AIPZ  [PZ_S-PQFP-G100]  58.9,26.39 0 bottom
IC204  TPS7323301  [SOT23-DBV]  67.9,11.83 270 bottom
IC205  TPS7323301  [SOT23-DBV]  10.15,35.01 0 bottom
IC206  STM32F205RIP  [SQFP-S-10X10-64]  32.94,27.33 180 bottom
IC207  DS2483RU  [SOT23-6L]  76.12,54.17 0 bottom
J201  687110183622  [XF2L-1025-1]  11.24,55.1 0 top
J202  104031-0811  [MOLEX_SD]  24.66,43.57 90 top
LI_CHG  LTC4062  [DFN10-3X3]  12.49,48.49 270 bottom
Q201  BC857ASMD  [SOT23-BEC]  14.3,53.54 90 bottom
Q202  FA2382.5X3.5  [FA238V]  71.41,25.1 180 bottom
Q203  ABM8G-12.000MHZ-18-D2Y-T  [FA238V]  24.31,30.09 270 bottom
R101  4.7M  [R0402]  60.44,68.2 180 top
R102  4.7m  [R0402]  60.44,66.15 180 top
R103  4.7M  [R0402]  59.72,51.67 90 top
R104  10k  [R0402]  63.49,31.84 90 top
R105  10k  [R0402]  63.47,28.19 90 top
R106  10k  [R0402]  86.62,54.85 0 top
R107  39k  [R0805]  87.12,61.76 90 top
R108  10k  [R0402]  86.57,56.09 0 top
R109  470k  [R0805]  81.22,52.51 180 top
R110  10k  [R0402]  72.42,47.42 0 top
R111  4.53k  [R0805]  53.99,27.86 180 top
R112  1.00M  [R0402]  51.32,27.86 90 top
R113  4.53k  [R0805]  58.06,27.84 0 top
R114  4.53k  [R0805]  54.02,24.38 180 top
R115  1.00M  [R0402]  60.77,28.12 90 top
R116  1.00M  [R0402]  51.36,24.78 90 top
R117  4.53k  [R0805]  58.06,25.76 0 top
R118  1.00M  [R0402]  60.8,25.16 90 top
R201  0  [R0402]  11.38,59.17 180 bottom
R202  33k  [R0402]  53.54,8.76 90 top
R203  1.5k  [R0402]  49.3,8.42 0 top
R204  22k  [R0805]  10.6,53.53 270 bottom
R205  1.2K  [R0805]  8.7,45.58 90 bottom
R206  680  [R0805]  12.07,45.31 0 bottom
R207  47k  [R0402]  13.59,51 180 bottom
R208  680k  [R0402]  53.41,12.93 270 top
R209  1k  [R0402]  17.61,54.86 90 top
R210  24K  [R0805']  10.67,22.12 0 top
R211  10k  [R0402]  13.66,21.29 270 top
R212  1.0  [R0402]  17.99,53.3 180 bottom
R213  1k  [R0402]  19.26,54.8 90 top
R214  1.0  [R0402]  18.04,51.6 0 bottom
R215  0  [R0402]  46.89,21.66 90 top
R216  10k  [R0402]  15.94,57.64 90 top
R217  1k  [R0402]  16.21,52.72 0 top
R218  10k  [R0402]  15.99,55.24 90 top
R219  47k  [R0402]  89.49,26.2 0 bottom
R220  1k  [R0402]  48.11,33.32 0 bottom
R221  1k  [R0402]  49.02,31.4 0 bottom
R222  18k  [R0805']  77.14,49.72 90 bottom
R223  18k  [R0805']  74.71,49.67 90 bottom
R224  10k  [R0402]  45.27,20.73 90 bottom
R225  47k  [R0402]  24.45,23.68 0 bottom
R226  47k  [R0402]  24.45,24.95 0 bottom
R227  47k  [R0402]  33.02,19.12 90 bottom
R228  47k  [R0402]  34.42,19.1 90 bottom
R229  22ohm  [R0402]  29.11,18.97 270 bottom
R230  22ohm  [R0402]  30.49,18.97 90 bottom
RN101  22k  [CTS742C083]  28.24,55.22 180 top
RN102  10k  [CTS742C083]  28.24,48.2 180 top
RN103  22k  [CTS742C083]  43.51,55.42 180 top
RN104  10k  [CTS742C083]  43.86,48.15 180 top
RN105  CTS742C083  [CTS742C083]  60.81,59.97 180 top
RN106  22k  [CTS742C083]  47.46,55.22 180 top
RN107  10k  [CTS742C083]  47.71,48.27 180 top
RN108  22k  [CTS742C083]  32.16,55.25 180 top
RN109  10k  [CTS742C083]  32.09,48.15 180 top
RN110  22k  [CTS742C083]  36.06,55.3 180 top
RN111  10k  [CTS742C083]  36.14,48.17 180 top
RN112  22k  [CTS742C083]  51.04,55.27 180 top
RN113  10k  [CTS742C083]  51.21,48.12 180 top
RN114  22k  [CTS742C083]  54.74,55.3 180 top
RN115  10k  [CTS742C083]  55.21,48.17 180 top
RN116  22k  [CTS742C083]  39.94,55.32 180 top
RN117  10k  [CTS742C083]  40.01,48.15 180 top
RN118  4.7M  [CTS742C083]  51.01,55.22 0 bottom
RN119  4.7M  [CTS742C083]  54.54,55.2 0 bottom
RN120  4.7M  [CTS742C083]  39.89,55.3 0 bottom
RN121  4.7M  [CTS742C083]  43.84,55.22 0 bottom
RN122  4.7M  [CTS742C083]  32.01,55.25 0 bottom
RN123  4.7M  [CTS742C083]  28.06,55.37 0 bottom
RN124  4.7M  [CTS742C083]  35.71,55.25 0 bottom
RN125  4.7M  [CTS742C083]  47.41,55.27 0 bottom
U101  ADS1298_PAG_64  [PAG64]  23.51,28.08 0 top
U102  ADG732BSUZ  [SU_48]  38.06,46.23 0 bottom
U103  ADS1298_PAG_64  [PAG64]  39.43,27.9 0 top
U104  ADS1298_PAG_64  [PAG64]  81.97,40.78 0 top
U105  DG4052EEN-T1-GE4  [QFN40P260X180X60-16N]  80.06,64.6 270 top
U106  ADS1298_PAG_64  [PAG64]  66.17,40.83 0 top
U$101  4x47pf  [CAP0508X4]  32.14,52.27 180 top
U$102  4x47pf  [CAP0508X4]  28.31,52.2 180 top
U$103  TVSMAX3208EU10  [UMAX10]  27.86,40.27 180 top
U$104  4x47pf  [CAP0508X4]  28.29,44.75 0 top
U$105  TVSMAX3208EU10  [UMAX10]  65.21,54.92 270 top
U$106  TVSMAX3208EU10  [UMAX10]  44.44,40.22 180 top
U$107  4x47pf  [CAP0508X4]  44.49,44.97 0 top
U$108  4x47pf  [CAP0508X4]  60.34,55.22 180 top
U$109  TVSMAX3208EU10  [UMAX10]  48.24,40.17 180 top
U$110  TVSMAX3208EU10  [UMAX10]  31.99,40.22 180 top
U$111  4x47pf  [CAP0508X4]  47.89,45 0 top
U$112  4x47pf  [CAP0508X4]  31.99,44.77 0 top
U$113  4x47pf  [CAP0508X4]  47.46,52.1 180 top
U$114  4x47pf  [CAP0508X4]  43.66,52.07 180 top
U$115  TVSMAX3208EU10  [UMAX10]  51.64,40.15 180 top
U$116  TVSMAX3208EU10  [UMAX10]  36.01,40.22 180 top
U$117  4x47pf  [CAP0508X4]  35.96,44.8 0 top
U$118  4x47pf  [CAP0508X4]  51.39,45.2 0 top
U$119  TVSMAX3208EU10  [UMAX10]  55.36,40.17 180 top
U$120  4x47pf  [CAP0508X4]  55.26,45.2 0 top
U$121  TVSMAX3208EU10  [UMAX10]  40.04,40.22 180 top
U$122  4x47pf  [CAP0508X4]  55.06,52.22 180 top
U$123  4x47pf  [CAP0508X4]  50.76,52.15 180 top
U$124  4x47pf  [CAP0508X4]  40.01,44.97 0 top
U$125  4x47pf  [CAP0508X4]  40.01,52.05 180 top
U$126  4x47pf  [CAP0508X4]  35.96,52.25 180 top
U$127  PNLRECEPT  [THROUGHHOLERECEPT]  41.99,60.92 180 bottom
U$128  TOUCHPRUF  [TOUCHPROOF]  75.16,69.52 0 bottom
U$129  TOUCHPRUF  [TOUCHPROOF]  84.86,69.67 0 bottom
U$130  TPS22942  [DCK]  18.56,66.5 180 top
U$131  MAX4996  [TQFN24-EP]  67.82,66.34 180 top
U$201  PJ040DM  [PJ040]  10.96,69.57 270 bottom
U$202  SS14-E3/5AT  [DO214AC]  11.59,57.05 180 bottom
U$203  FSI-140-03-G-D-M-AD-TR  [FSI-110-03-X-D-E-AD]  46.46,10.96 180 bottom
U$204  PINHD-2X4-050  [2X04/90-050]  88.66,20.5 90 bottom
U$205  MAX4996  [TQFN24-EP]  42.77,11.2 0 top
X201  009176002  [009176002]  11.14,27.3 90 top

## Tracks (layer width: path | path; a pad name or v marks a point on that pad's centre or on a via)
1.20V  (via drill 0.5 layers 1-4)
  Top 0.12: R114.1 57.21,24.38 R117.1 57.16,25.76 57.16,25.77 R117.1 R113.1 57.21,27.86 R111.1 54.84,29.86 C148.1 57.43,29.86 C146.1 57.43,29.9 59.76,30.3 v59.76,31.15 | R105.2 63.47,29.98 v63.49,30 R104.1 | R103.1 59.72,48.51 v59.71,48.5
  Route2 0.12: v59.76,31.15 61.64,29.97 63.46,29.97 v63.49,30
  Route3 0.12: v59.71,48.5 59.71,31.2 v59.76,31.15
1WIRE  (1 unrouted)
  Bottom 0.12: U$127.P$1 57.23,55.18 59.26,53.15 72.94,53.15 72.91,54.02 72.84,54.52 72.94,54.75 73.11,54.82 74.49,56.42 76.14,56.42 76.14,55.52 | 76.11,55.55 76.14,55.52 | 76.14,55.52 76.14,55.47 76.11,55.45
1WSCL  (via drill 0.5 layers 13-16)  (2 unrouted)
  Route14 0.12: v52.22,36.38 52.22,36.1 52.9,35.42 59.58,35.42 59.6,35.44 59.68,35.44 60.18,35.94 67.75,35.94 67.78,35.97 67.78,42.02 72.27,46.51 72.27,46.55 72.91,47.18 72.91,49.73 v73.07,49.89
  Bottom 0.12: v52.22,36.38 52.22,36.17 52.89,35.5 52.89,34 IC203.51 | v73.07,49.89 73.78,50.61
  Bottom 0.406: R223.2 74.71,52.41 IC207.3
1WSDA  (via drill 0.5 layers 13-16)  (1 unrouted)
  Route14 0.12: v52.83,28.3 71.88,28.3 71.98,28.2 72.06,28.2 72.91,29.05 76.22,29.05 76.22,29.04 76.62,29.04 77.65,30.07 77.65,36.1 82.71,41.17 82.71,49.7 v81.7,50.71
  Bottom 0.12: v52.83,28.3 52.39,28.3 52.28,28.4 51.31,28.4 IC203.42 | v81.71,50.71 77.18,50.71 R222.2
  Bottom 0.406: IC207.2 76.12,51.68 R222.2
2.4V  (via drill 0.08 layers 1-2, 0.08 layers 15-16, 0.5 layers 1-4, 0.6)  (1 unrouted)
  Top 0.12: 63.38,32.49 R104.2 64.17,32.49 64.44,32.22 64.44,26.95 64.56,26.95 65.19,26.32 65.19,23.44 | 65.19,23.44 C128.1 76.25,23.31 78.84,25.9 78.84,26.89 IC102.1 IC102.2 v80.59,28.22 | 65.19,23.44 63.86,23.44 C125.1 63.65,23.27 62.94,23.27 62.51,22.85 v62.36,22.85 | U$131.19 v66.56,64.52 v66.54,63.7
  Route2 0.12: U$131.11 v66.56,64.52
  Route4 0.12: v66.54,63.7 67.61,63.32 68.26,62.22 72.84,62.22 72.96,55.7 72.91,55.02 81.51,45.67 81.51,44.57 81.49,44.55 81.49,41.6 80.76,40.62 80.76,33.87 | 80.74,33.87 80.76,33.87 | 80.76,33.87 80.89,33.67 80.86,28.5 v80.59,28.22
  Route15 0.12: v60.91,18.8 60.91,21.4 v62.36,22.85
  other vias: 67.07,68.17
!1WRST!  (via drill 0.5 layers 13-16)  (1 unrouted)
  Route14 0.12: v54.72,36.85 63.03,36.85 63.43,37.25 63.45,37.25 63.53,37.34 64.1,37.34 64.11,37.35 64.16,37.35 64.76,36.75 66.77,36.75 66.83,36.81 66.83,42.15 71.28,46.59 71.28,48.1 71.28,48.11 71.28,48.24 70.81,48.72 70.81,50.06 74.63,53.89 78.64,53.89 78.71,53.62 v78.77,53.56
  Bottom 0.12: v54.72,36.85 54.72,36.08 54.14,35.5 53.69,35.5 53.43,35.23 53.43,34.02 IC203.52 | IC207.1 78.08,52.87 v78.78,53.56
!CS1!  (via drill 0.6)
  Top 0.12: U106.39 73.24,40.07 73.29,36.45 v74.34,36.5
  Route14 0.12: v52.81,30.22 53.94,31.3 57.19,31.3 57.91,32.42 74.39,32.65 v74.34,36.5
  Bottom 0.12: IC203.43 52.84,28.9 v52.81,30.22
!CS2!  (via drill 0.08 layers 15-16, 0.5 layers 13-16, 0.6)
  Top 0.12: U104.39 78.8,40.02 78.66,39.87 78.66,36.82 78.24,36.7 78.16,36.67 77.34,35.85 76.86,35.85 v76.56,35.55
  Route14 0.12: v59.31,29.4 67.06,29.4 68.34,30.67 71.29,30.67 71.44,30.7 71.59,30.7 72.24,30.12 75.64,30.12 76.56,31.05 v76.56,35.55
  Route15 0.12: v51.31,29.4 v59.31,29.4
  Bottom 0.12: v51.31,29.4 IC203.44
!CS3!  (via drill 0.6)
  Top 0.12: U103.39 48.49,27.14 48.51,27.12 48.51,27.95 v49.09,28.52
  Bottom 0.12: v49.09,28.52 49.09,29.25 49.71,29.87 51.29,29.87 IC203.45
!CS4!  (via drill 0.5 layers 1-4, 0.6)
  Top 0.12: 29.06,27.37 U101.39 27.59,27.32 27.59,30.47 v27.46,30.35
  Route4 0.12: v27.46,30.35 34.61,30.35 34.71,30.5 34.96,30.75 35.71,30.75 36.04,30.52 42.11,30.62 42.54,30.62 v42.56,30.65
  Bottom 0.12: IC203.46 51.21,30.3 50.21,30.3 49.96,30.55 43.01,30.57 42.64,30.57 v42.56,30.65
!DRDY!  (via drill 0.08 layers 1-2, 0.6)
  Top 0.12: U106.47 v71.77,44.08 v71.76,44.07
  Route2 0.12: v71.76,44.07 69.81,44.07 69.79,44.05 69.79,42.87 66.09,39.17 v65.24,39.17
  Route3 0.12: v65.24,39.17 60.76,34.7 60.76,26.72 v56.34,21.2
  Bottom 0.12: v56.34,21.2 54.59,21.37 53.41,20.2 53.41,18.8 IC203.24
!PD!  (via drill 0.08 layers 1-2, 0.5 layers 1-4, 0.6)  (2 unrouted)
  Top 0.12: U104.35 87.58,38.05 88.11,38.02 | v31.91,24.85 30.96,24.85 30.46,25.35 v29.11,25.35 | 45.04,25.15 U103.35 45.05,25.15 v45.09,25.15 | 45.04,25.15 U103.35 45.06,25.15 | 45.04,25.15 43.16,25.15 v42.84,24.87 | 71.76,38.07 U106.35
  Route2 0.12: 68.27,38.08 68.29,38.1 | 68.29,38.1 68.26,38.1 63.14,33.17 49.84,33.2 49.86,31.37 48.21,29.8 48.21,27.72 47.44,26.95 47.44,26.4 47.36,26.32 47.36,26.3 46.21,25.15 v45.09,25.15 | U104.35 71.83,38.03 U106.35 68.3,38.08 68.29,38.1
  Route4 0.12: 42.81,24.8 v42.84,24.87 42.66,24.87 36.46,24.92 35.86,25.25 35.19,25.25 34.54,24.9 33.94,24.85 v31.91,24.85
  Bottom 0.12: 42.84,24.85 41.79,24.85 41.34,25.17 41.11,25.6 40.64,26.47 40.64,28.95 41.66,29.97 42.14,29.97 43.44,28.67 46.91,28.67 47.79,27.9 48.26,27.87 | 48.21,27.87 48.26,27.87 | 48.26,27.87 IC203.41
  Bottom 0.127: 42.86,24.85 42.84,24.85 v42.84,24.87
  other vias: 87.58,38.03 71.78,38.08
!RESET!  (via drill 0.08 layers 1-2, 0.5 layers 1-4, 0.6)  (2 unrouted)
  Top 0.12: 31.01,25.57 v30.96,25.62 30.76,25.82 v29.11,25.82 | v41.91,25.55 42.01,25.64 U103.36
  Route2 0.12: v45.09,25.65 46.24,25.65 47.04,26.45 47.06,26.45 47.14,26.52 47.14,27.12 47.59,27.57 47.61,27.57 47.86,27.82 47.86,29.9 49.36,31.3 49.36,33.45 49.41,33.5 63.04,33.5 67.99,38.47 68.01,38.52 68.06,38.57 U106.36 87.58,38.57 U104.36
  Route4 0.12: v30.96,25.62 v41.91,25.55
  Bottom 0.12: 41.91,25.52 v41.91,25.55 41.04,26.42 41.04,27.3 41.51,27.77 42.09,27.77 42.59,27.35 46.34,27.17 49.71,23.67 49.84,22.92 50.39,22.37 51.29,22.37 IC203.30
  other vias: 87.58,38.52 71.78,38.57
!RST!  (via drill 0.08 layers 15-16)  (1 unrouted)
  Route15 0.12: v66.54,22.4 82.04,22.4 83.06,23.45 83.51,23.9 89.89,23.9 89.89,23.08 U$204.P$7
  Bottom 0.12: 89.89,23.08 U$204.P$7 R219.2 C203.1
!TESTZ!  (via drill 0.08 layers 15-16, 0.5 layers 13-16)
  Route14 0.12: v64.61,37.75 62.89,37.75 62.84,37.7 59.56,37.7 59.24,38.02 54.14,38.02 54.06,37.95 54.06,37.87 53.74,37.42 51.19,37.52 51.16,37.55 42.49,37.55 42.39,37.65 42.36,37.65 v41.46,38.55
  Route15 0.12: IC203.8 61.4,20.91 63.04,22.55 63.04,25.22 63.84,26.02 63.84,26.42 65.59,27.72 65.51,35.65 64.61,36.27 v64.61,37.75
  Bottom 0.12: IC203.8 | 36.31,42.1 U102.22 36.31,40.78 36.71,40.37 36.71,39.17 v41.46,38.55
  other vias: 61.4,18.79
+3V3  (via drill 0.08 layers 1-2, 0.6)  (10 unrouted)
  Top 0.12: U$119.8 55.34,37.32 54.64,37.2 v53.49,36.22 | U$115.8 51.66,37.27 51.69,37.25 52.49,37.25 53.51,36.22 | U106.59 64.92,47.6 | 64.92,47.6 64.92,47.69 64.69,47.92 64.59,47.92 C141.1 62.77,48.48 C143.1 62.71,48.45 v61.21,48.45 | C142.1 C144.1 | C144.1 69.76,48.35 69.41,48 69.41,47.6 | 69.41,47.6 U106.50 | U106.48 R110.1 | R110.1 71.78,48.13 71.66,48.45 70.03,48.45 C144.1 | 71.79,48.15 v71.79,49.05 71.81,49.07 | U106.56 66.39,46.44 66.39,47.6 64.92,47.6 | U106.54 67.46,46.44 67.46,47.6 69.41,47.6 | C137.1 85.48,48.16 | 85.48,48.16 C138.1 86.8,48.14 v86.89,48.05 87.58,47.35 U104.48 88.72,44.54 88.74,44.52 88.74,42.57 87.63,42.57 U104.44 | 85.48,48.16 85.48,47.84 85.21,47.57 U104.50 | C135.1 C136.1 80.46,47.73 80.69,47.5 80.69,46.43 U104.59 80.73,45.36 80.71,45.35 82.24,45.35 | 82.24,45.35 82.24,46.38 U104.56 | 82.24,45.35 83.21,45.35 83.24,45.37 83.24,46.35 83.21,46.37 | U104.22 U104.21 80.29,35.1 80.29,33.32 v80.26,33.25 79.23,33.61 U104.19 | R110.1 | v46.39,36.47 46.61,36.47 47.21,37.07 48.21,37.07 48.24,37.1 U$109.8 | v46.39,36.47 46.14,36.47 45.54,37.07 44.46,37.07 44.44,37.05 U$106.8 | v36.74,36.05 36.79,36.97 | 40.01,37.95 U$121.8 | v36.74,36.05 36.76,36.02 36.71,37.05 36.04,37.15 36.01,37.12 U$116.8 | v29.69,36.52 30.11,36.52 30.69,37.1 31.94,37.1 31.99,37.15 U$110.8 | v29.69,36.52 29.44,36.52 28.79,37.17 27.94,37.17 27.89,37.12 27.89,38 U$103.8 | 38.21,35.3 38.21,35.62 37.91,35.92 37.91,36.15 | 38.21,35.3 38.21,33.55 U103.59 38.18,31.73 38.24,31.67 38.26,31.67 38.84,31.1 39.29,31.1 39.66,31.47 39.66,33.5 U103.56 39.68,32.4 39.69,32.4 40.71,32.4 | C117.1 46.3,36.38 v46.39,36.47
  Top 0.12: C117.1 47.56,35.13 C121.1 | C117.1 46.24,35.07 45.69,35.07 45.04,34.43 U103.48 45.03,31.67 42.89,31.67 42.68,31.88 42.68,32.3 | U103.50 42.68,32.3 | v35.81,20.25 35.99,20.3 35.99,20.82 36.36,20.82 36.36,21 36.69,21.32 U103.19 | U103.19 | U103.19 36.69,23.45 36.64,23.5 37.61,23.5 | 37.61,23.5 38.16,23.5 38.21,23.45 38.21,22.35 38.19,22.32 | 37.61,23.5 37.61,22.42 37.71,22.32 | v29.69,36.52 29.16,35.99 C111.1 29.76,35.09 C110.1 | C110.1 29.18,31.9 U101.48 | C110.1 29.43,32.7 29.19,32.7 27.69,32.7 27.56,32.57 26.81,32.57 26.79,32.55 26.79,33.66 U101.50 | v20.11,35.9 20.13,35.88 20.13,35.83 20.36,35.6 21.45,35.6 C109.1 21.56,35.32 22.26,34.62 U101.59 | U$105.8 68.79,54.92 71.81,51.9 71.81,49.07 | 20.76,22.45 20.79,22.45 20.79,23.37 21.66,24.25 v21.89,24.25 21.89,23.92 22.29,23.52 22.29,22.49 U101.22 U101.21 | v45.79,11.05 45.69,10.95 U$205.15 U$205.14 | v48.45,11.86 48.48,11.86 48.49,11.87 | v20.11,35.9 20.11,36.32 | IC102.8 v68.62,26.91 v68.61,26.92 | v63.99,67.8 65.31,67.05 U$131.14 | v71.91,66.45 IC101.8 | v83.74,64.82 81.94,64.37 U105.14 | 23.76,32.65 U101.56 23.76,32.67 23.74,32.65 | 23.76,32.65 23.74,32.65 | 23.74,32.65 22.29,32.65 22.26,32.67 U101.59 | U101.59 | 23.76,32.65 24.76,32.65 24.79,32.67 24.79,33.66 U101.54 | 36.74,36.95 37.24,36.95 37.91,37.62 37.91,38.22 38.79,39.1 39.99,39.1 40.04,39.05 40.04,38 40.06,37.97 | 40.71,32.4 40.71,33.48 | 40.67,32.44 40.71,32.4 | 40.71,32.4 42.58,32.4 42.68,32.3 | IC103.8 83.54,55.02 v83.61,54.95 | 78.89,48.17 72.69,48.17 71.89,48.97 71.81,49.05 71.81,49.07 | U106.22 U106.21 64.41,34.12 | 64.41,34.12 63.41,34.12 U106.19 | v66.56,33.47 64.44,33.5 64.41,34.12
  Top 0.12: 37.91,36.15 C120.1 | C118.1 38.29,35.37 38.21,35.3 | 37.91,36.15 36.84,36.15 v36.74,36.05 | R216.1 16.59,56.82 v17.24,56.62 17.01,56.3 16.84,56.12 16.84,55.02 16.66,54.85 16.25,54.85 R218.1 15.55,54.59 14.74,53.85 J201.8 | C108.1 20.72,36.51 v20.11,35.9
  Route2 0.12: v45.79,11.05 46.6,11.86 v48.45,11.86 v48.46,11.87 50.39,11.87 52.85,9.41 v53.54,9.41
  Route15 0.12: 59.4,33.99 58.41,33.65 55.36,33.75 v53.49,36.22
  Bottom 0.12: IC203.11 59.89,18.8 59.89,19.97 59.21,20.65 v59.16,20.65 58.11,20.65 57.4,19.94 IC203.16 | R223.1 74.76,48.77 R222.1 72.07,48.77 v71.79,49.05 | IC203.87 68.58,26.89 v68.61,26.92 | R219.1 90.74,24.42 90.76,20.9 U$204.P$3 | v49.31,26.15 49.91,26.15 50.14,26.37 51.29,26.37 IC203.38 | U102.14 U102.13 40.89,42.02 v42.26,42.02 | v77.49,57.15 77.49,56.8 77.06,56.37 IC207.6 | 18.99,45.15 18.86,45.12 v18.94,45.2
  Bottom 0.305: 18.99,45.15 17.76,46.62 IC202.5
  pour Route12: 7.86,68.72 90.86,68.75 90.89,18.27 76.56,18.22 76.59,15.52 71.89,15.4 71.91,11.35 76.56,11.4 76.61,3.25 21.54,3.27 21.54,11.35 25.91,11.52 25.86,15.4 21.66,15.27 21.46,18.22 7.86,18.22
ACLK  (via drill 0.08 layers 1-2, 0.5 layers 1-4, 0.6)  (4 unrouted)
  Top 0.12: v31.86,26.22 31.34,26.22 31.29,26.27 29.16,26.27 v29.11,26.32 | U103.37 42.88,26.15 v42.81,26.22 | v73.26,35.37 72.99,35.4 72.91,39.08 U106.37
  Route2 0.12: v87.59,39.02 87.53,39.08 U106.37 68.29,39.08 68.21,39 68.06,39 62.89,33.82 48.94,33.82 48.91,33.8 48.89,31.27 48.51,30.87 48.46,30.87 47.61,30.02 47.61,28 46.79,27.17 46.79,26.55 46.69,26.45 46.56,26.45 46.21,26.15 v45.06,26.15
  Route4 0.12: v31.86,26.22 41.26,26.2 42.84,26.22
  Bottom 0.12: IC203.84 73.26,28.39 v73.26,35.37
  other vias: 71.78,39.08
AGND  (via drill 0.08 layers 1-2, 0.6, 0.6 pad 0.25)  (7 unrouted)
  Top 0.12: U101.57 U101.58 22.74,34.45 22.76,34.47 C109.2 22.79,35.52 C108.2 22.79,36.47 v23.81,36.47 | U$118.P$3 U$118.P$2 U$118.P$1 v50.64,44.45 | U$118.P$3 U$118.P$4 52.59,44.55 v53.39,44.12 54.19,44.55 U$120.P$1 U$120.P$2 | U$120.P$4 U$120.P$3 U$120.P$2 | U$115.3 51.56,43.32 51.66,43.72 51.66,44.52 U$118.P$3 | U$119.3 55.34,43.5 55.04,43.8 55.04,44.52 U$120.P$2 | U106.58 65.4,45.11 65.69,44.82 | 65.69,44.82 v66.06,44.45 66.56,44.95 67.69,44.95 67.92,45.18 | U106.57 65.91,45.05 65.69,44.82 | U106.53 67.92,45.18 | 67.92,45.18 68.91,46.17 U106.51 | C143.2 62.77,49.68 C141.2 67.02,49.68 | 67.02,49.68 v68.51,51.17 | 69.93,49.75 v68.51,51.17 | 68.68,51.01 v68.51,51.17 | C147.2 67.04,49.61 C145.2 67.06,49.68 67.02,49.68 | C134.2 69.57,29.15 v69.44,29.15 67.66,29.15 67.66,27.95 66.13,27.95 C131.2 66.13,27.85 64.84,27.85 64.81,31.35 C130.2 | C134.2 68.79,30.94 C133.2 | 68.79,30.9 67.54,30.9 C132.2 | U106.32 69.94,35.21 69.89,34.2 70.69,34.2 70.76,30.95 C134.2 | 63.89,36.72 v63.88,36.7 U106.20 63.91,36.44 63.91,36.45 65.39,36.45 | U106.23 65.39,35.21 65.39,36.45 | 65.39,36.45 66.41,36.45 66.41,36.37 66.42,36.37 U106.25 | 63.16,26.83 v63.16,26.62 63.47,26.93 R105.1 | U$107.P$1 U$107.P$2 | U$107.P$2 U$107.P$3 U$107.P$4 | U$107.P$4 45.24,44.35 45.26,44.37 | v86.86,49.9 86.3,49.34 C138.2 84.3,49.34 C137.2 82.93,49.36 C140.2 82.86,49.38 C139.2 80.96,49.38 | 80.96,49.38 80.47,49.38 C136.2 C135.2 | v84.49,44.75 84.49,45.1 84.71,45.32 U104.51 U104.52 U104.53 | U104.57 U104.58 | 81.24,46.35 81.24,47.47 81.11,47.6 81.11,49.37 81.09,49.4 80.98,49.4 80.96,49.38 | U104.23 81.21,36.4 81.19,36.42 | 81.19,36.42 82.24,36.42
  Top 0.12: 82.24,36.42 82.24,35.18 U104.25 | U104.32 85.73,36.38 85.71,36.4 83.71,36.4 | 83.71,36.4 82.26,36.4 82.24,36.42 | U104.20 79.71,36.35 79.79,36.42 81.19,36.42 | 83.71,36.4 83.69,36.42 83.69,37.05 v84.21,37.02 87.69,37.02 | C129.2 86.14,31.05 C126.2 85.06,31.04 84.44,30.77 84.11,30.65 v84.14,30.65 84.07,30.73 C124.2 83.65,31.7 82.69,31.7 82.54,31.84 C127.2 C123.2 79.93,31.94 79.21,31.22 79.21,31.12 IC102.4 | U$107.P$2 44.24,43.47 44.49,43.22 44.49,42.52 U$106.3 | 46.71,51.42 U$113.P$5 | U$113.P$5 U$113.P$6 U$113.P$7 U$113.P$8 | v45.66,53.07 45.66,52.67 | 45.66,52.67 U$114.P$8 U$114.P$7 U$114.P$6 U$114.P$5 42.89,51.4 U$125.P$8 U$125.P$7 U$125.P$6 U$125.P$5 | U$126.P$8 36.74,51.57 36.24,51.57 U$126.P$7 U$126.P$6 U$126.P$5 34.51,51.6 v34.24,51.32 33.94,51.62 U$101.P$8 U$101.P$7 U$101.P$6 U$101.P$5 29.14,51.62 U$102.P$8 U$102.P$7 U$102.P$6 U$102.P$5 | U$124.P$2 U$124.P$1 38.51,44.32 38.21,44.62 v38.06,44.62 37.59,44.15 U$117.P$4 U$117.P$3 | U$124.P$2 U$124.P$3 U$124.P$4 | U$104.P$2 U$104.P$3 U$104.P$4 30.16,44.1 v30.16,44.15 31.21,44.15 U$112.P$1 U$112.P$2 | U$104.P$2 U$104.P$1 | U$104.P$2 27.86,44.1 U$103.3 | U$112.P$2 U$112.P$3 U$112.P$4 | U$110.3 31.96,42.47 31.96,43.4 31.79,43.57 31.79,44.07 U$112.P$2 | U$117.P$3 U$117.P$2 U$117.P$1 | U$116.3 36.01,43.4 36.04,43.42 36.06,43.42 36.24,43.6 36.24,44.12 U$117.P$3 | U$121.3 40.04,43.4 39.71,43.72 39.71,44.27 U$124.P$2 | v38.94,31.9 38.94,33.24 | 38.94,33.24 U103.58 | 38.94,33.24 38.94,33.28 U103.57 39.17,35.17 C118.2 39.49,36.5 C120.2 | C122.2 43.42,35.3 43.44,35.32 | 43.44,35.32 v43.81,35.7 | C122.2 C119.2 | C122.2 42.31,33.65 U103.51 U103.52 U103.53
  Top 0.12: 43.44,35.32 43.44,34.7 43.19,34.45 43.19,33.55 43.16,33.52 | C117.2 46.34,33.89 C121.2 47.19,33.48 v47.19,32.07 47.19,31.45 46.39,30.65 U103.46 U103.45 U103.44 46.17,29.66 46.19,29.67 46.19,28.7 45.07,28.7 U103.42 U103.41 | 43.19,24.25 v41.54,24.25 40.34,24.25 39.68,23.59 | 43.19,24.25 U103.32 | U103.20 37.16,21.1 37.14,21.07 36.86,21.07 36.64,20.77 36.66,19.55 v35.89,18.82 36.06,19 C112.2 37.3,18.95 38.54,18.95 C114.2 38.65,18.95 C113.2 40.89,18.2 41.51,18.2 41.5,18.28 C115.2 41.83,18.37 42.36,18.9 43.11,18.9 C116.2 | 43.19,24.25 43.91,24.25 44.01,24.15 U103.33 | U103.25 39.68,23.59 | U103.23 38.66,23.57 39.66,23.57 39.68,23.59 | C110.2 31.01,31.19 30.61,30.8 29.14,30.8 | 29.14,30.8 U101.46 | v32.31,34.52 32.11,34.52 31.51,33.92 31.05,33.92 C110.2 | C110.2 31.01,35.09 C111.2 | v28.51,35.57 27.96,35.5 27.31,34.85 27.31,33.74 U101.49 27.27,34.82 27.26,34.82 26.24,34.82 | 86.2,43.04 U104.45 U104.46 | 86.2,43.04 v84.49,44.75 | U104.41 U104.42 86.14,41.54 86.11,41.57 86.11,42.95 86.2,43.04 | U$105.3 62.86,54.82 62.09,54.82 61.76,54.5 61.11,54.5 61.09,54.52 U$108.P$8 U$108.P$7 U$108.P$6 U$108.P$5 59.54,54.52 59.06,54.52 56.11,51.57 U$122.P$8 U$122.P$7 U$122.P$6 U$122.P$5 54.31,51.5 v53.29,51.5 U$123.P$8 U$123.P$7 U$123.P$6 U$123.P$5 | U101.33 U101.32 27.27,19.55 27.21,19.5 26.58,19.5 C105.2 25.8,19.44 C104.2 24.58,18.85 | 24.58,18.85 C103.2 23.39,19.44 | 23.39,19.44 C102.2 21.65,19.44 C101.2 | 24.58,18.85 24.39,18.85 v23.46,17.92 | U101.25 23.76,21.62 23.44,21.17 23.41,19.47 23.39,19.44 | U101.20 21.25,21.41 21.24,21.4 | 21.24,21.4 22.76,21.4 22.76,22.45 U101.23
  Top 0.12: 21.24,21.4 20.81,21.4 20.76,21.35 20.76,19.52 20.84,19.45 21.64,19.45 21.66,19.42 | v12.86,32.25 12.86,29.52 X201.2 | v45.79,9.85 45.68,9.95 U$205.13 42.81,9.95 42.71,10.05 42.71,11.14 U$205.EXP | R211.2 14.81,20.64 v15.11,20.95 | R215.1 46.89,19.67 v46.96,19.6 | v76.89,65.72 78.82,65.72 78.82,65.44 | 78.82,65.44 U105.5 U105.6 77.99,64.8 76.91,64.85 76.96,62.15 77.06,62.05 78.19,62.07 78.36,61.9 78.36,60.3 v78.34,60.27 IC103.4 | U$131.13 v65.54,68.37 U$131.12 66.64,68.17 66.64,67.07 67.82,67.07 U$131.EXP 67.09,65.15 U$131.20 | C146.2 55.41,31.54 C148.2 55.23,30.97 54.76,30.97 54.26,30.47 v54.26,30.4 | 26.24,34.82 26.24,33.7 U101.51 U101.52 U101.53 | U106.33 70.36,37.07 70.36,41.07 70.39,41.07 70.39,41.08 U106.41 U106.42 70.31,41.6 70.31,43.09 | U106.52 U106.51 | U106.51 68.91,44.87 69.91,44.87 | 69.91,44.87 69.94,44.87 | 69.94,44.87 69.94,44.95 69.92,44.95 U106.49 69.91,44.87 | 69.94,44.87 70.26,44.87 70.26,43.52 71.78,43.52 U106.46 U106.45 70.31,43.09 | 70.31,43.09 70.31,43.1 | U104.49 85.73,45.12 85.44,44.82 84.56,44.82 v84.49,44.75 | 45.29,44.37 U$107.P$4 | U$109.3 48.24,43.7 48.14,43.8 U$111.P$3 | 45.66,52.67 45.66,52.5 U$113.P$5 | 29.14,30.8 29.14,30.36 U101.45 U101.44 31.39,29.91 31.56,29.82 31.59,28.82 31.44,28.72 U101.42 U101.41 | IC101.4 v75.11,61.12 | C125.2 65.26,22.05 C128.2 | 68.86,19.7 66.04,19.9 65.41,19.92 65.39,22.05 65.34,22.1 | U105.4 78.82,65.44 | v63.04,57.77 62.86,57.77 61.99,56.9 61.99,54.7 62.01,54.67 | 69.93,49.75 68.89,49.75 C142.2 | 69.93,49.75 C144.2 | U$111.P$1 v47.14,44.3 47.59,44.3 U$111.P$2 U$111.P$3 | U$111.P$3 U$111.P$4 v48.64,44.45
  Top 0.12: 26.24,34.82 26.24,35.34 C107.2 26.02,35.55 C106.2
  Route2 0.12: v78.34,60.27 77.54,60.27 76.69,61.12 v75.11,61.12 | v47.14,44.3 46.16,44.3 U$107.P$4 | v48.64,44.45 v50.64,44.45
  Bottom 0.12: v63.88,36.7 62.41,36.7 62.19,36.92 60.19,36.92 60.19,36.28 C201.2 | 37.3,43.07 U102.20 U102.21 | 37.3,43.07 37.3,43.86 v38.06,44.62 | 37.3,43.07 37.25,43.12 35.84,43.12 35.8,43.09 U102.23 U102.24
  Bottom 0.305: v19.51,50.57 19.19,50.57 18.76,50.15 18.76,49.27 IC202.2
  other vias: 68.89,19.7 45.24,44.32
  pour Route5: 7.86,68.72 90.86,68.82 90.84,18.22 76.56,18.22 76.54,15.35 71.96,15.37 72.04,11.5 72.61,11.5 76.56,11.62 76.56,3.27 21.54,3.32 21.64,11.27 25.86,11.5 25.96,15.52 21.56,15.35 21.46,18.22 7.86,18.22
  pour Bottom: 11.76,49.62 13.24,49.62 13.24,47.4 11.76,47.4
B1  (via drill 0.08 layers 1-2)  (1 unrouted)
  Top 0.12: U105.15 v81.34,64.8 | v63.91,46.62 63.91,46.43 63.91,46.42
  Route2 0.12: v63.91,46.62 76.14,46.94 77.86,45.07 83.59,45.07 83.61,45.05 83.61,45.1 84.06,45.55 87.94,45.57 87.89,45.57 87.81,51.57 87.79,51.65 87.79,52.95 86.61,53.52 86.54,65.57 86.39,65.72 83.41,65.7 83.11,65.22 82.31,64.82 81.36,64.82 v81.34,64.8
B2  (via drill 0.08 layers 1-2)
  Top 0.12: v79.86,65.42 U105.3 | 79.71,46.37 U104.61
  Route2 0.12: U104.61 79.71,64.7 79.86,64.85 v79.86,65.42
  other vias: 79.71,46.39
B3  (via drill 0.5 layers 1-4)  (1 unrouted)
  Top 0.12: v35.59,36.15 35.59,35.72 36.49,34.82 37.09,34.82 37.16,34.75 U103.61 | v82.84,65.82 82.79,65.82 82.19,65.22 81.33,65.22 U105.16
  Route3 0.12: 35.59,36.12 35.56,36.12 35.56,39.12 36.84,39.12 37.71,40 37.71,43.25 38.71,44.17 38.59,49.27 38.94,49.25 64.96,49.77 69.84,55.2 69.94,55.25 73.54,58.85 73.54,59.47 73.51,59.5 75.46,59.5 78.06,62.1 82.44,62.1 82.84,62.5 v82.84,65.82
B4  (via drill 0.5 layers 1-4)
  Top 0.12: v19.04,36.32 arc45 19.12,36.11 19.71,34.82 21.2,34.82 arc-45 21.26,34.8 21.26,33.73 arc-45 U101.61 | v80.21,66.9 80.21,65.56 arc45 U105.2
  Route4 0.12: v80.21,66.9 79.98,66.9 arc-45 79.86,66.95 arc-45 79.7,66.87 72.74,66.57 72.74,65.4 72.73,65.41 70.35,65.41 70.05,69.05 55.94,69.1 54.58,68.17 arc-45 54.35,68.07 24.54,68.07 21.39,64.92 21.39,47 19.99,45.6 19.99,37.27 v19.04,36.32
BAT2
  Bottom 0.12: U$127.P$50 26.61,62.83
  Bottom 0.305: 26.61,62.83 26.61,60.7 25.16,59.25 25.16,54.65 24.91,54.25 24.66,54.25 24.49,54.22 20.41,54.22 20.26,54.17 19.36,54.02 R212.2
  Bottom 0.406: R212.2 18.64,53.25
BATTERY  (via drill 0.08 layers 15-16, 0.5 layers 13-16, 0.6)  (2 unrouted)
  Top 0.12: R210.1 X201.1 | v14.89,25 11.44,25
  Top 0.305: 11.44,25 X201.1
  Route14 0.12: 20.99,36.92 20.99,34.9 20.11,34.02 19.94,34.02 16.41,30.5 16.39,30.5 15.44,29.55 15.44,25.55 14.86,24.97
  Route14 0.305: 20.26,51.65 20.26,37.65 20.99,36.92
  Route15 0.12: 26.61,17.67 21.51,22.77 14.94,22.77 14.84,22.67 14.84,24.95 v14.89,25
  Route15 0.305: IC204.1 69.2,14.46 69.14,14.52 59.81,14.52 58.49,13.2 58.44,13.2 57.56,12.32 57.54,6.65 49.26,6.62 44.84,6.55 44.94,14.15 38.61,14.12 37.24,12.75 34.46,12.75 30.59,15.97 26.59,16 26.61,16.45 26.61,17.67
  Bottom 0.12: IC205.1 12.63,33.71 14.41,31.92 14.41,25.47 v14.89,25
  Bottom 0.305: R214.1 20.24,51.6 v20.29,51.65
  other vias: 69.2,12.78
BOOTALFAT  (via drill 0.08 layers 15-16)  (1 unrouted)
  Route15 0.12: v64.9,34.01 64.9,32.48 64.81,32 60.24,31.87 56.71,31.25 52.56,31.12 49.96,29.55 43.56,29.6 41.31,28.12 v38.96,28.07
  Bottom 0.12: IC203.75 v64.9,34.01 | v38.96,28.07 IC206.23
BT_GOOD  (via drill 0.08 layers 15-16, 0.5 layers 13-16)
  Route14 0.12: v54.96,13.85 54.96,14.62 55.14,14.8 55.14,20.67 54.51,21.3 54.51,25.97 v54.61,26.07
  Bottom 0.12: v54.61,26.07 54.61,25.95 52.56,23.9 51.31,23.9 IC203.33 | U$203.19 55.16,15.85 v54.96,13.85
  other vias: 54.96,15.65
BTCTS  (via drill 0.6)
  Top 0.12: v50.94,14.22 46.89,14.22 46.51,13.4 46.46,9.45 45.74,8.87 42.01,8.87 41.99,8.85 41.99,9.34 U$205.8
  Bottom 0.12: U$203.15 arc90 50.94,15.63 v50.94,14.22
BTRTS
  Bottom 0.12: IC203.17 56.94,18.79 56.56,13.3 53.06,13.25 52.99,14.5 52.96,14.5 U$203.17
BTRXDS  (via drill 0.5 layers 13-16, 0.6)
  Top 0.12: v52.01,14.2 52.01,13.7 52.01,13.55 47.29,13.49 46.89,13.27 46.89,9.35 46.14,8.6 41.49,8.6 41.49,9.34 U$205.7
  Route14 0.12: v52.01,14.2 52.04,14.27 52.04,15.5 51.99,15.55 49.29,15.55 49.26,15.57 49.21,15.52 46.41,15.52 46.19,15.75 46.19,26.8 46.59,27.2 v49.26,27.2
  Bottom 0.12: U$203.16 arc-90 52.01,15.6 v52.01,14.2 | v49.26,27.2 51.24,27.32 IC203.40
BTTXD  (via drill 0.08 layers 15-16)
  Route15 0.12: U$203.18 53.96,17.45 53.94,17.47 56.39,17.47 56.46,17.4 56.46,19.1 57.81,20.45 57.81,23.12 57.59,23.35 57.59,24.07 54.76,26.9 v51.31,26.9 IC203.39
  Bottom 0.12: v51.31,26.9 IC203.39 | U$203.18 54.09,15.45
  other vias: 53.96,15.65
BTVCC
  Bottom 0.12: C208.1 69.72,7.94 C206.1 67.96,8.06 C207.1 66.26,8.55 65.44,9.37 65.44,12.07 65.89,12.07 IC204.5 | 66.62,12.8 IC204.5 | IC204.5 42.4,12.18 39.99,15.02 U$203.4 U$203.3
CALN  (via drill 0.08 layers 1-2, 0.5 layers 1-4)
  Top 0.12: U104.18 78.72,34.03 78.66,33.97 77.69,33.97 77.64,34.02 77.64,34.05 77.34,34.35 72.69,34.35 72.61,34.27 72.61,34.45 70.76,36.3 67.74,36.3 67.71,36.32 67.69,36.32 66.66,37.37 63.64,37.37 62.84,36.57 62.84,35.29 U106.18 62.92,34.89 | v36.19,22.17 36.17,22.18 U103.18 36.21,22.33 36.21,23.72 36.16,23.77 35.51,23.77 34.51,22.77 34.51,18.07 34.71,17.87 39.74,17.87 40.46,17.55 41.24,17.52 41.94,17.5 45.59,17.57 49.31,17.57 49.44,21.67 | 62.92,34.89 62.94,34.87 | 62.92,34.89 62.92,34.1 62.54,33.65 62.64,28.57 62.71,28.5 62.69,28.5 62.51,28.57 62.54,25.25 62.56,25.22 61.84,23.47 61.79,23.42 59.61,21.92 49.44,21.67 | U101.18 v20.26,22.13 v20.26,22.12 | R111.2 53.14,28.51 R112.2 v51.31,28.5 | 49.44,21.67 49.96,21.67 v49.96,20.87
  Route2 0.12: v20.26,22.12 36.14,22.12 v36.19,22.17 | v51.31,28.5 50.26,28.5 50.26,28.37 49.96,28.37 v49.96,20.87
CALP  (via drill 0.08 layers 1-2)
  Top 0.12: U106.17 62.41,36.55 62.34,36.62 62.39,36.62 63.41,37.65 66.74,37.65 67.89,36.65 70.84,36.65 72.54,34.95 72.56,34.95 72.91,34.6 77.64,34.6 U104.17 | v35.66,22.47 v35.67,22.47 U103.17 35.64,22.26 35.64,21.3 35.01,21.3 35.04,21.27 35.06,18.12 39.89,18.12 40.69,17.8 43.51,17.8 48.96,18 49.09,21.97 59.41,22.2 61.54,23.6 61.61,23.67 62.21,25.1 62.19,25.05 62.21,25.17 62.18,25.52 62.14,28.3 | U106.17 62.41,35.39 62.41,35.4 | 62.14,28.3 62.16,33.84 62.26,33.95 62.29,33.95 62.41,34.07 U106.17 | U101.17 19.75,22.69 v19.74,22.7 | R113.2 59.84,28.77 R115.2 62.16,28.77 62.14,28.3
  Route2 0.12: v35.66,22.47 33.74,22.47 | 33.74,22.47 33.74,22.45 | 33.74,22.47 22.06,22.47 21.76,22.77 19.81,22.77 v19.74,22.7
CHG  (via drill 0.08 pad 0.25 layers 15-16, 0.5 layers 13-16)
  Route14 0.12: U$127.P$25 27.71,59.02 29.06,60.37 29.06,60.45 29.21,60.6 29.21,61.12 29.26,61.17 29.46,61.17 30.44,62.15 30.71,62.15 30.74,62.17 30.76,62.17 31.74,61.2 31.89,61.2 33.06,62.37 33.24,62.37 34.34,61.27 34.59,61.27 35.66,62.35 35.79,62.35 36.76,61.37 37.06,61.37 38.16,62.47 38.19,62.47 39.26,61.4 39.64,61.4 40.71,62.47 40.84,62.47 42.06,61.25 43.24,62.42 43.26,62.42 44.24,61.45 44.24,60.85 45.56,59.52 46.21,59.52 47.09,60.4 47.16,60.4 47.24,60.5 47.29,60.5 48.39,59.37 48.46,59.37 49.66,60.57 49.69,60.57 50.84,59.42 50.84,58.3 51.71,57.42 56.81,57.3 57.04,57.27 57.14,46.97 57.19,41.07 58.19,40.07 61.86,40.07 v61.41,40.02
  Route15 0.12: 22.99,62.78 U$127.P$25 | v61.41,34 v61.41,36.27 v61.41,40.02
  Route15 0.305: U$201.P$3 8.96,62.8 10.09,63.92 22.49,63.92 22.99,63.42 22.99,62.78
  Bottom 0.12: C201.1 v61.41,36.27 | v61.41,34 IC203.68
DGND  (via drill 0.08 layers 15-16, 0.5 layers 13-16, 0.6, 0.6 pad 0.25)  (5 unrouted)
  Top 0.12: R215.2 46.89,23.65 v46.81,23.72 | IC201.2 51.18,10.95 51.94,10.95 53.27,12.28 R208.2 53.5,12.37 C202.2 54.88,12.35 55.44,12.35 57.04,13.95 v57.29,13.95 | v13.66,59.27 13.34,59.27 11.96,57.9 11.96,56.52 | 11.96,56.52 12.14,56.35 | J202.G$1 24.21,49.21 J202.S$2 18.22,49.17 16.06,49.17 15.04,48.15 v15.04,47.92 15.01,47.9 15.01,47.1 13.73,45.81 J202.G$4 | J202.G$3 14.89,38.54 v14.89,38.25 15.32,37.81 J202.G$2 23.65,37.81 23.11,38.35 23.11,40.85 23.19,40.92 24.11,40.92 J202.P$6 | 11.96,56.52 12.09,56.52 12.26,56.35 J201.3
  Top 0.305: U$130.2 18.56,68.45 17.46,68.45 17.04,68.02 17.04,68 13.09,64.05 13.09,61.7 U$201.P$2
  Route13 0.12: 55.23,67.75 54.66,65.02 U$127.P$28 | 40.76,29.97 40.76,26.85 40.79,26.82 | 31.81,31 31.81,30.9 32.59,30.12 32.59,27.32 32.64,27.27
  Route13 0.305: 62.51,58.64 63.31,58.64 63.44,58.52 63.51,58.52 64.11,57.92 64.11,57.65 64.14,57.75 64.16,57.72
  Route13 0.406: 14.64,67.85 55,67.85 arc-45 55.23,67.75 62.51,60.75 62.51,58.64 | 64.19,57.7 71.43,57.7 arc45 71.65,57.79 73.76,60.47 80.59,60.32 arc45 80.46,60.35 88.53,60.22 arc-45 88.98,59.78 89.14,59.62 89.14,38.12 arc45 89.19,38
  Route15 0.12: v75.2,55.44 v71.69,57.8
  Bottom 0.12: C210.2 21.86,25.97 v21.84,25.95 21.86,25.97 24.64,25.97 24.69,26.02 C212.2 arc45 24.76,27.3 24.76,27.62 26.18,29.05 arc45 26.24,29.17 26.24,30.32 arc-90 26.26,30.35 arc-90 26.49,30.58 IC206.63 27.37,30.55 31.04,30.55 31.21,30.72 31.51,30.72 v31.81,31.02 32.16,31.37 32.16,31.6 32.41,31.85 34.66,31.85 34.66,32.9 IC206.12 | v76.34,26.42 v76.33,26.42 C204.2 73.39,27.46 C205.2 | v64.56,26.22 65.26,26.22 65.41,26.37 66.49,26.37 IC203.88 | 66.26,6.22 C207.2 C206.2 C208.2 70.39,6.77 70.39,7.9 v71.46,11.75 IC204.2 | 38.01,15.65 U$203.2 U$203.1 v38.01,17.87 39.16,17.87 C215.2 | IC203.12 59.4,17.78 59.61,17.57 59.79,17.57 v61.11,16.85 60.38,17.21 IC203.10 | IC203.15 57.9,19.86 57.91,19.87 59.39,19.87 59.41,19.85 59.41,18.8 | 8.5,42.19 v8.56,42.25 8.56,44.59 R205.1 | C211.2 10,39.86 | 11.45,40.37 C213.2 | 58.99,34.17 IC203.63 | C216.2 27.59,18.35 27.59,16.95 v27.71,16.82 | 10.51,40.37 10.44,40.37 | C214.2 37.92,17.96 | IC203.37 51.39,25.97 v53.41,26.05 53.44,27.15 53.44,31.05 58.76,31.25 IC203.63 | C209.2 58.04,35.97 58.91,35.1 IC203.63 | R224.1 45.57,20.08 46.19,20.7 46.19,23.2 46.21,23.22 46.31,23.22 v46.81,23.72 | 75.19,55.45 v75.2,55.44 | v40.79,29.97 40.11,29.97 40.04,29.9 | 40.04,29.9 40.04,30.47 39.94,30.57 IC206.18 | IC206.24 39.82,27.58 40.04,27.8 40.04,29.9
  Bottom 0.15: R206.1 12.89,45.31 12.89,45.32 12.49,45.32
  Bottom 0.2: LI_CHG.3 LI_CHG.EXP
  Bottom 0.305: 10,39.86 10.51,40.37 11.45,40.37 | 12.49,45.32 12.49,43.95 9.89,42.77 8.64,42.32 v8.56,42.25 10.44,40.37 | 12.89,45.32 12.89,47.57 12.49,47.97 LI_CHG.EXP | v13.66,59.27 13.46,60.05 U$201.P$2 | v10.16,31.8 IC205.2 | 37.92,17.96 v38.01,17.87 | v89.51,30.62 89.51,29.89 C203.2 | v86.94,19.1 87.24,19.1 87.84,18.37 89.56,18.35 89.54,18.55 89.54,18.83 U$204.P$1
  pour Route13: 7.74,68.67 15.41,68.67 15.41,65.57 15.41,44.5 15.41,35.75 21.56,35.75 21.56,35.6 21.56,27.97 67.46,27.97 67.59,27.97 67.59,38.25 90.21,38.25 90.21,37.95 90.21,18.45 71.84,18.45 71.84,3.47 27.24,3.47 27.24,4.27 27.24,19.05 7.59,19.05 7.59,19.17 7.74,19.17
E1C
  Top 0.12: RN114.1 55.84,56.1 55.84,59.55 55.81,59.55 54.79,60.57 54.56,60.57 53.41,59.42 52.55,59.42 U$127.P$5
  Bottom 0.12: U$127.P$5 52.15,56.96 RN118.8
E1P  (via drill 0.08 layers 1-2)  (1 unrouted)
  Top 0.12: RN115.8 56.41,46.25 U$120.P$5
  Route2 0.12: U$120.P$5 56.01,45.07 56.11,44.97 56.11,44.45 56.31,44.25 56.31,42.52 U$119.1 58.91,42.5 59.01,42.4 59.16,42.4 59.34,42.57 62.56,42.57 63.01,42.5 63.11,37.57 62.59,37.22 v60.56,37.07
  other vias: 56.01,45.85 56.36,42.42
E2C
  Top 0.12: RN114.2 55.14,57.9 55.11,58.1 51.79,58.15 51.26,58.62 51.26,60.54 U$127.P$6
  Bottom 0.12: U$127.P$6 50.88,59.74 51.26,59.52 51.26,58.62 51.56,58.32 51.46,57.82 51.46,56.07 RN118.7
E2P  (via drill 0.08 layers 1-2, 0.5 layers 1-4)  (1 unrouted)
  Top 0.12: U$120.P$6 55.51,46.42 55.69,46.6 55.69,47.3 RN115.7 | U$119.9 55.84,37.17 55.89,37.12 57.29,37.12 57.46,37.3 57.46,38.05 57.5,38.08 U106.14 v60.54,38.1 60.51,38.1 | 55.64,47.3 55.64,48.12 59.04,48.12 63.01,44.42 63.09,38.27 63.06,38.25 v62.49,38.25